# EAGLE schematic BEP33_12panel stencil (EAGLE 7.7.0), part 2 of 4
## Sheet 6 of 14
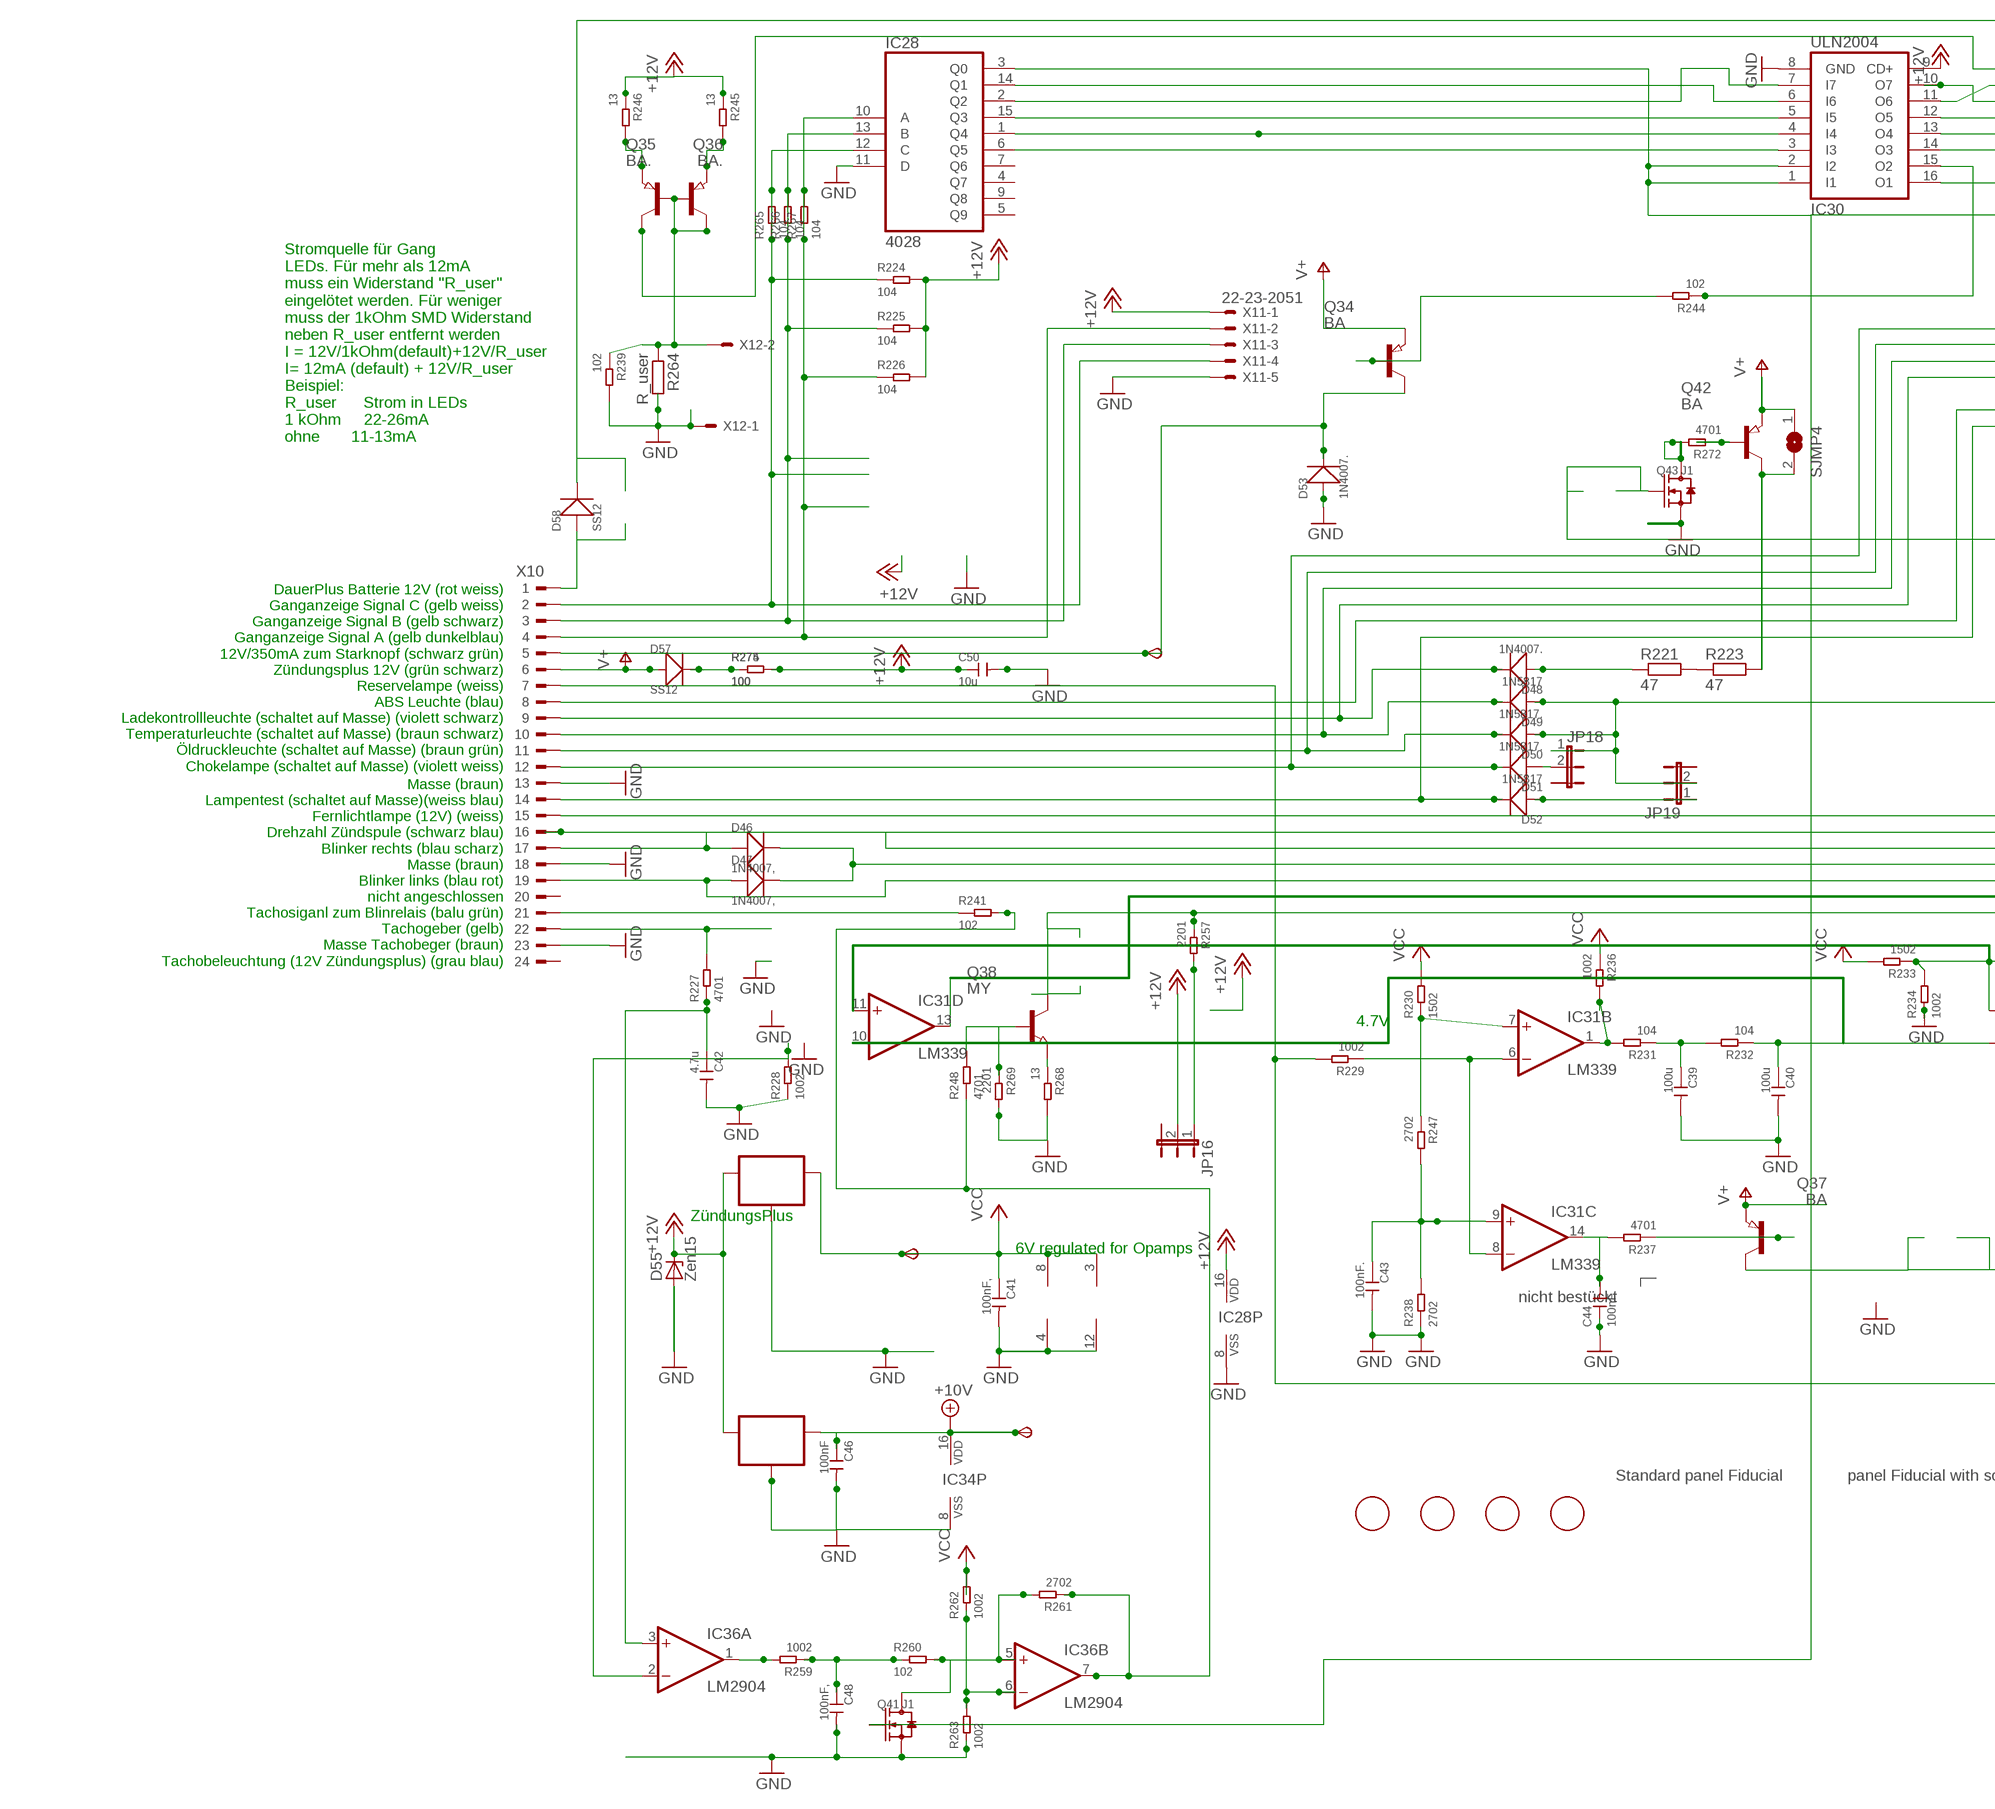
[diagram p9: schematic, sheet 6, part 1 of 2]
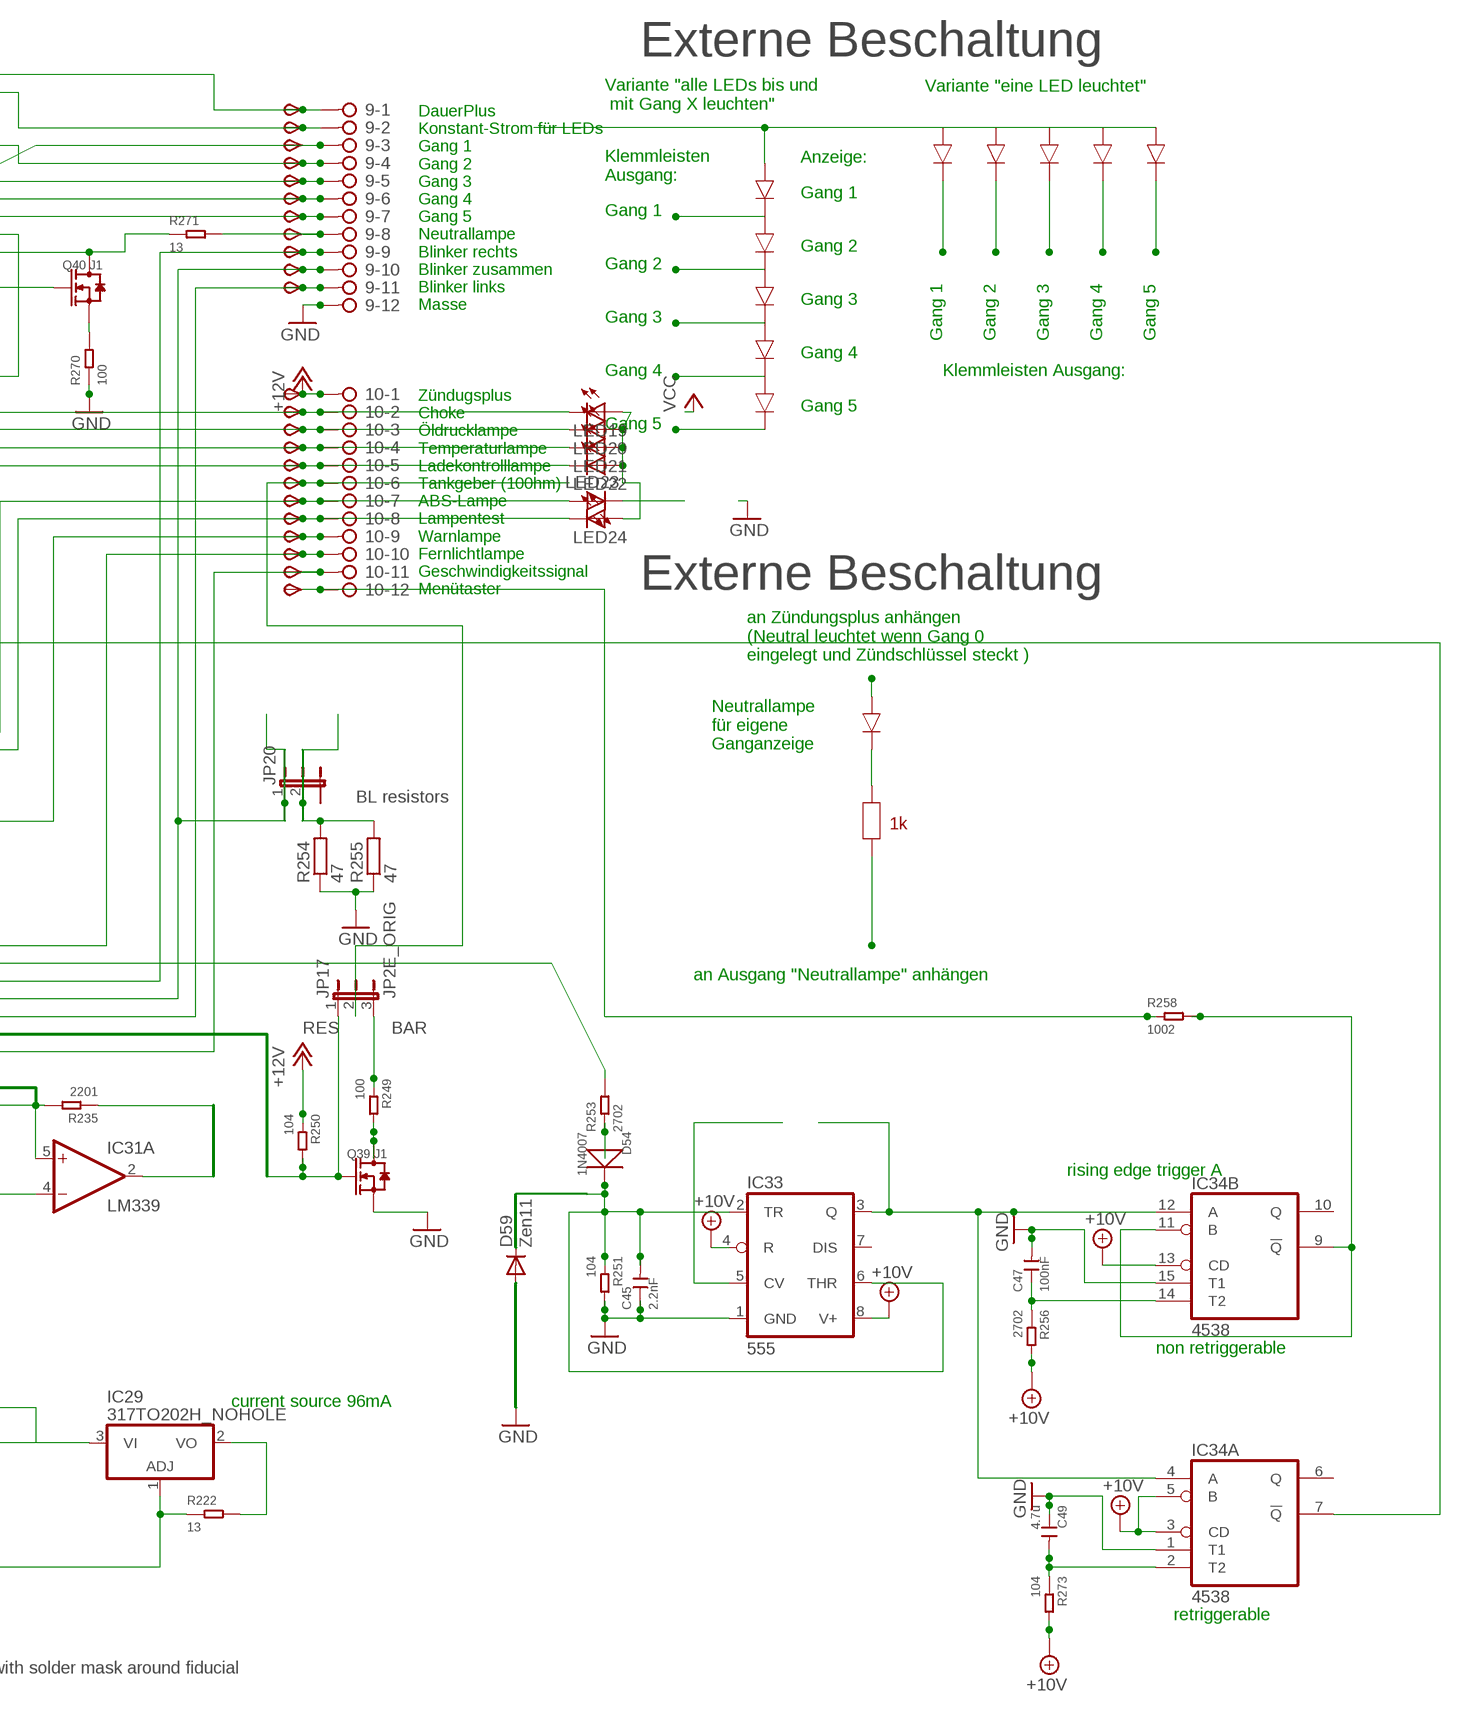
[diagram p10: schematic, sheet 6, part 2 of 2]

### Parts
6V4  TPSB2.0  [B2.0]
9  2081-1132  [12-PIN]
10  2081-1132  [12-PIN]
10V4  TPSB2.0  [B2.0]
C39  100u  CERAMIC-100UF-6.3V-20%-X5R(1206)  [C1206]
C40  100u  CERAMIC-100UF-6.3V-20%-X5R(1206)  [C1206]
C41  100nF,  CERAMIC-100NF-50V-10%-X7R(0805)  [C0805]
C42  4.7u  CERAMIC-4.7UF-25V-10%-X5R(0805)  [C0805]
C43  100nF.  CERAMIC-100NF-50V-10%-X7R(0805)  [C0805]
C44  100nF.  CERAMIC-100NF-50V-10%-X7R(0805)  [C0805]
C45  2.2nF  CERAMIC-100NF-50V-10%-X7R(0805)  [C0805]
C46  100nF  CERAMIC-100NF-50V-10%-X7R(0805)  [C0805]
C47  100nF  CERAMIC-100NF-50V-10%-X7R(0805)  [C0805]
C48  100nF,  CERAMIC-100NF-50V-10%-X7R(0805)  [C0805]
C49  4.7u  CERAMIC-4.7UF-25V-10%-X5R(0805)  [C0805]
C50  10u  CERAMIC-100UF-6.3V-20%-X5R(1206)  [C1206]
D46  1N4007,  DIODE-GEN-PURPOSE-1KV-1A(DO-214AC)  [DO-214AC]
D47  1N4007,  DIODE-GEN-PURPOSE-1KV-1A(DO-214AC)  [DO-214AC]
D48  1N4007.  DIODE-GEN-PURPOSE-1KV-1A(DO-214AC)  [DO-214AC]
D49  1N5817  DIODE-GEN-PURPOSE-1KV-1A(DO-214AC)DO-214AC/1206  [DO-214AC_SLIM]
D50  1N5817.  DIODE-GEN-PURPOSE-1KV-1A(DO-214AC)DO-214AC/1206  [DO-214AC_SLIM]
D51  1N5817.  DIODE-GEN-PURPOSE-1KV-1A(DO-214AC)DO-214AC/1206  [DO-214AC_SLIM]
D52  1N5817  DIODE-GEN-PURPOSE-1KV-1A(DO-214AC)DO-214AC/1206  [DO-214AC_SLIM]
D53  1N4007.  DIODE-GEN-PURPOSE-1KV-1A(DO-214AC)  [DO-214AC]
D54  1N4007  DIODE-GEN-PURPOSE-1KV-1A(DO-214AC)  [DO-214AC]
D55  Zen15  SM6T  [DO214AA]
D57  SS12  DIODE-GEN-PURPOSE-1KV-1A(DO-214AC)DO-214AC/1206  [DO-214AC_SLIM]
D58  SS12  DIODE-GEN-PURPOSE-1KV-1A(DO-214AC)DO-214AC/1206  [DO-214AC_SLIM]
D59  Zen11  CGRM4001-G  [SOD-123_MINI-SMA]
FID15  FIDUCIAL  [FIDUCIAL_1MM]
FID16  FIDUCIAL  [FIDUCIAL_1MM]
FID17  FIDUCIAL  [FIDUCIAL_1MM]
FID18  FIDUCIAL  [FIDUCIAL_1MM]
IC28  4028  4028D  [SO16]
IC29  317TO202H_NOHOLE  [TO220H_NOHOLE]
IC30  ULN2004  ULN2004AD  [SO16]
IC31  LM339  LM339D  [SO14]
IC32  78L06  78LXXSOT89_ROUND  [SOT89_ROUND]
IC33  555  NE555D  [SO08]
IC34  4538  4538D  [SO16]
IC35  78L10  78LXXSOT89_ROUND  [SOT89_ROUND]
IC36  LM2904  LM358D  [SO08]
JP16  JP2EJP2_SMALLPADS  [JP2_SMALLPADS]
JP17  JP2E_ORIG  [JP2_ORIG_SMALLPADS]
JP18  JP2EJP2_SMALLPADS  [JP2_SMALLPADS]
JP19  JP2EJP2_SMALLPADS  [JP2_SMALLPADS]
JP20  JP2EJP2_SMALLPADS  [JP2_SMALLPADS]
LED19  LEDLD260  [LD260]
LED20  LEDLD260  [LD260]
LED21  LEDLD260  [LD260]
LED22  LEDLD260  [LD260]
LED23  LEDLD260  [LD260]
LED24  LEDLD260  [LD260]
Q34  BA  PNP-TRANSISTOR_SOT89  [SOT89]
Q35  BA.  PNP-TRANSISTOR_SOT89  [SOT89]
Q36  BA.  PNP-TRANSISTOR_SOT89  [SOT89]
Q37  BA  PNP-TRANSISTOR_SOT89  [SOT89]
Q38  MY  NPN-TRANSISTOR_SOT89  [SOT89]
Q39  J1  SMD-MOSFET-N-CH-50V-200MA-BSS138W-7-F(SOT-23)  [SOT-23]
Q40  J1  SMD-MOSFET-N-CH-50V-200MA-BSS138W-7-F(SOT-23)  [SOT-23]
Q41  J1  SMD-MOSFET-N-CH-50V-200MA-BSS138W-7-F(SOT-23)  [SOT-23]
Q42  BA  PNP-TRANSISTOR_SOT89  [SOT89]
Q43  J1  SMD-MOSFET-N-CH-50V-200MA-BSS138W-7-F(SOT-23)  [SOT-23]
R221  47  R-EU_V235/17_1MM  [V235/17_1MM]
R222  13  SMD-RES-13R-5%-1/4W(1206)  [R1206]
R223  47  R-EU_V235/17_1MM  [V235/17_1MM]
R224  104  SMD-RES-10K-1%-1/8W(0805)  [R0805]
R225  104  SMD-RES-10K-1%-1/8W(0805)  [R0805]
R226  104  SMD-RES-10K-1%-1/8W(0805)  [R0805]
R227  4701  SMD-RES-4.7K-5%-1/8W(0805)  [R0805]
R228  1002  SMD-RES-10K-1%-1/8W(0805)  [R0805]
R229  1002  SMD-RES-10K-1%-1/8W(0805)  [R0805]
R230  1502  SMD-RES-10K-1%-1/8W(0805)  [R0805]
R231  104  SMD-RES-10K-1%-1/8W(0805)  [R0805]
R232  104  SMD-RES-10K-1%-1/8W(0805)  [R0805]
R233  1502  SMD-RES-10K-1%-1/8W(0805)  [R0805]
R234  1002  SMD-RES-10K-1%-1/8W(0805)  [R0805]
R235  2201  SMD-RES-2.2K-5%-1/8W(0805)  [R0805]
R236  1002  SMD-RES-10K-1%-1/8W(0805)  [R0805]
R237  4701  SMD-RES-4.7K-5%-1/8W(0805)  [R0805]
R238  2702  SMD-RES-4.7K-5%-1/8W(0805)  [R0805]
R239  102  SMD-RES-1K-5%-1/8W(0805)  [R0805]
R241  102  SMD-RES-220R-5%-1/8W(0805)  [R0805]
R244  102  SMD-RES-1K-5%-1/8W(0805)  [R0805]
R245  13  SMD-RES-13R-5%-1/4W(1206)  [R1206]
R246  13  SMD-RES-13R-5%-1/4W(1206)  [R1206]
R247  2702  SMD-RES-4.7K-5%-1/8W(0805)  [R0805]
R248  4701  SMD-RES-4.7K-5%-1/8W(0805)  [R0805]
R249  100  SMD-RES-2.2K-5%-1/8W(0805)  [R0805]
R250  104  SMD-RES-10K-1%-1/8W(0805)  [R0805]
R251  104  SMD-RES-10K-1%-1/8W(0805)  [R0805]
R253  2702  SMD-RES-10K-1%-1/8W(0805)  [R0805]
R254  47  R-EU_V235/17_1MM  [V235/17_1MM]
R255  47  R-EU_V235/17_1MM  [V235/17_1MM]
R256  2702  SMD-RES-4.7K-5%-1/8W(0805)  [R0805]
R257  2201  SMD-RES-2.2K-5%-1/8W(0805)  [R0805]
R258  1002  SMD-RES-4.7K-5%-1/8W(0805)  [R0805]
R259  1002  SMD-RES-10K-1%-1/8W(0805)  [R0805]
R260  102  SMD-RES-1K-5%-1/8W(0805)  [R0805]
R261  2702  SMD-RES-4.7K-5%-1/8W(0805)  [R0805]
R262  1002  SMD-RES-1K-5%-1/8W(0805)  [R0805]
R263  1002  SMD-RES-1K-5%-1/8W(0805)  [R0805]
R264  R_user  R-EU_R0805  [R0805]
R265  104  SMD-RES-10K-1%-1/8W(0805)  [R0805]
R266  104  SMD-RES-10K-1%-1/8W(0805)  [R0805]
R267  104  SMD-RES-10K-1%-1/8W(0805)  [R0805]
R268  13  SMD-RES-13R-5%-1/4W(1206)  [R1206]
R269  2201  SMD-RES-1K-5%-1/8W(0805)  [R0805]
R270  100  SMD-RES-220R-5%-1/8W(0805)  [R0805]
R271  13  SMD-RES-13R-5%-1/4W(1206)  [R1206]
R272  4701  SMD-RES-4.7K-5%-1/8W(0805)  [R0805]
R273  104  SMD-RES-4.7K-5%-1/8W(0805)  [R0805]
R274  100  SMD-RES-2.2K-5%-1/8W(0805)  [R0805]
R275  100  SMD-RES-2.2K-5%-1/8W(0805)  [R0805]
SJMP4  SJ  [SJ]
START4  TPSB2.0  [B2.0]
TP93  TPSB2.0  [B2.0]
TP94  TPSB2.0  [B2.0]
TP95  TPSB2.0  [B2.0]
TP96  TPSB2.0  [B2.0]
TP97  TPSB2.0  [B2.0]
TP98  TPSB2.0  [B2.0]
TP99  TPSB2.0  [B2.0]
TP100  TPSB2.0  [B2.0]
TP101  TPSB2.0  [B2.0]
TP102  TPSB2.0  [B2.0]
TP103  TPSB2.0  [B2.0]
TP104  TPSB2.0  [B2.0]
TP105  TPSB2.0  [B2.0]
TP106  TPSB2.0  [B2.0]
TP107  TPSB2.0  [B2.0]
TP108  TPSB2.0  [B2.0]
TP109  TPSB2.0  [B2.0]
TP110  TPSB2.0  [B2.0]
TP111  TPSB1,27  [B1,27]
TP112  TPSB2.0  [B2.0]
TP113  TPSB2.0  [B2.0]
TP114  TPSB2.0  [B2.0]
TP115  TPSB2.0  [B2.0]
X10  CON_BMWV2  [24-PIN_V2]
X11  22-23-2051  [22-23-2051]
X12  22-23-2021  [22-23-2021]

### Nets
+10V: 10V4.TP(PP) C46.1 IC33.4(R) IC33.8(V+) IC34.3(A:CD) IC34.5(A:B) IC34.13(B:CD) IC34.16(P:VDD) IC35.1(OUT) R256.2 R273.2 ; also sheet 2,3,4,5,7,9,10,11,12,13,14
+12V: 10.1 C50.1 D55.C IC28.16(VDD) IC30.9(CD+) IC32.3(IN) IC35.3(IN) JP16.2 R224.2 R225.2 R226.2 R245.1 R246.1 R250.1 R274.2 R275.2 TP114.TP(PP) X11.1 ; also sheet 2,3,4,5,7,9,10,11,12,13,14
+12V5: 10.11 Q38.2(C) R257.1 TP113.TP(PP)
GND: 9.12 C39.2 C40.2 C41.2 C42.2 C43.2 C44.1 C45.1 C46.2 C47.2 C48.2 C49.1 C50.2 D53.1(+) D55.A D59.A IC28.8(VSS) IC28.11(D) IC30.8(GND) IC31.12(P:GND) IC32.2(GND) IC32.2@1(GND) IC33.1(GND) IC34.1(A:T1) IC34.8(P:VSS) IC34.15(B:T1) IC35.2(GND) IC35.2@1(GND) IC36.4(P:V-) Q39.2(S) Q41.2(S) Q43.2(S) R228.1 R234.1 R238.1 R239.2 R251.2 R254.1 R255.1 R263.1 R264.2 R268.2 R269.2 R270.1 X10.13 X10.18 X10.23 X11.5 X12.1 ; also sheet 2,3,4,5,7,9,10,11,12,13,14
N$939: R221.2 R223.1
N$940: 10.9 D49.1(+) D50.1(+) JP18.1 JP19.2 TP111.TP(PP)
N$941: IC28.10(A) R226.1 R267.1 R267.2 X10.4 X11.2
N$942: IC28.13(B) R225.1 R266.1 R266.2 X10.3 X11.3
N$943: D53.2(-) Q34.2(C) START4.TP(PP) X10.5
N$944: IC28.12(C) R224.1 R265.1 R265.2 X10.2 X11.4
N$945: 10.7 LED23.A TP109.TP(PP) X10.8
N$946: 10.2 D51.2(-) LED19.K(C) TP104.TP(PP) X10.12
N$947: 10.3 D50.2(-) LED20.K(C) TP105.TP(PP) X10.11
N$948: 10.4 D49.2(-) LED21.K(C) TP106.TP(PP) X10.10
N$949: 10.8 D52.2(-) LED24.K(C) TP110.TP(PP) X10.14
N$950: 9.9 D46.1(+) TP101.TP(PP) X10.17
N$951: 9.11 D47.1(+) TP103.TP(PP) X10.19
N$952: R227.2 X10.22
N$953: C42.1 IC36.3(A:+IN) R227.1
N$954: IC31.1(B:OUT) R231.2 R236.2
N$955: C39.1 R231.1 R232.2
N$956: C40.1 IC31.4(A:-IN) IC31.10(D:-IN) R232.1
N$957: IC31.5(A:+IN) IC31.11(D:+IN) R233.1 R234.2 R235.2
N$958: C43.1 IC31.9(C:+IN) R238.2 R247.2
N$959: C44.2 IC31.14(C:OUT) R237.2
N$960: Q37.1(B) R237.1
N$961: IC28.2(Q2) IC30.7(I7)
N$962: 9.5 IC30.12(O5) TP97.TP(PP)
N$963: IC28.1(Q4) IC30.4(I4)
N$964: 10.10 TP112.TP(PP) X10.15
N$965: 10.5 D48.2(-) LED22.K(C) TP107.TP(PP) X10.9
N$966: D48.1(+) R221.1
N$967: IC28.6(Q5) IC30.3(I3)
N$968: 9.4 IC30.10(O7) TP96.TP(PP)
N$969: IC29.1(ADJ) R222.1 R229.2 X10.7
N$970: IC31.6(B:-IN) IC31.8(C:-IN) R229.1
N$971: 9.2 Q36.2(C) TP94.TP(PP)
N$972: 9.1 D58.2(-) TP93.TP(PP)
N$986: R253.2 X10.16
N$987: IC28.15(Q3) IC30.5(I5)
N$988: 9.6 IC30.13(O4) TP98.TP(PP)
N$989: 9.7 IC30.14(O3) TP99.TP(PP)
N$990: 10.6 JP17.2 TP108.TP(PP)
N$991: LED23.K(C)
N$992: LED19.A LED20.A LED21.A LED22.A LED24.A
N$993: Q34.1(B) R244.2
N$994: IC28.3(Q0) IC30.1(I1) IC30.2(I2) Q40.1(G) Q41.1(G)
N$995: IC28.14(Q1) IC30.6(I6)
N$996: 9.3 IC30.11(O6) TP95.TP(PP)
N$997: Q35.1(B) Q35.2(C) Q36.1(B) R239.1 R264.1 X12.2
N$998: Q36.3(E) R246.2
N$999: Q35.3(E) R245.2
N$1000: IC31.7(B:+IN) R230.1 R247.1
N$1001: IC36.2(A:-IN) R228.2
N$1002: Q38.1(B) R248.2 R269.1
N$1003: Q39.3(D) R249.2
N$1004: IC29.2(VO) R222.2
N$1005: IC29.3(VI) Q37.2(C)
N$1006: IC33.5(CV)
N$1007: IC33.3(Q) IC34.4(A:A) IC34.12(B:A)
N$1008: D54.1(+) R253.1
N$1009: 9.10 D46.2(-) D47.2(-) JP20.1 TP102.TP(PP)
N$1010: JP20.2 R254.2 R255.2
N$1011: IC34.9(B:!Q) IC34.11(B:B) R258.2
N$1012: C47.1 IC34.14(B:T2) R256.1
N$1013: JP16.1 R257.2
N$1014: IC30.15(O2) R244.1
N$1015: 10.12 R258.1 TP115.TP(PP)
N$1016: D51.1(+) JP18.2
N$1017: IC36.1(A:OUT) R259.2
N$1018: C48.1 R259.1 R260.1
N$1019: IC36.5(B:+IN) Q41.3(D) R260.2 R261.2
N$1020: IC36.6(B:-IN) R262.1 R263.2
N$1021: D52.1(+) JP19.1
N$1022: JP17.3 R249.1
N$1023: IC31.13(D:OUT) JP17.1 Q39.1(G) R250.2
N$1024: R241.1 X10.21
N$1025: IC30.16(O1) Q40.3(D) R271.1
N$1026: D57.2(-) R274.1 R275.1
N$1027: 9.8 R271.2 TP100.TP(PP)
N$1028: Q40.2(S) R270.2
N$1029: D58.1(+) X10.1
N$1030: Q38.3(E) R268.1
N$1031: C45.2 D54.2(-) D59.C IC33.2(TR) IC33.6(THR) R251.1
N$1032: Q42.1(B) R272.1
N$1033: Q43.3(D) R272.2
N$1034: Q42.2(C) R223.2 SJMP4.2
N$1035: IC36.7(B:OUT) R241.2 R248.1 R261.1
N$1036: IC31.2(A:OUT) R235.1
N$1037: IC34.7(A:!Q) Q43.1(G)
N$1038: C49.2 IC34.2(A:T2) R273.1
V+: D57.1(+) Q34.3(E) Q37.3(E) Q42.3(E) SJMP4.1 X10.6 ; also sheet 2,3,4,5,7,9,10,11,12,13,14
VCC: 6V4.TP(PP) C41.1 IC31.3(P:V+) IC32.1(OUT) IC36.8(P:V+) R230.2 R233.2 R236.1 R262.2 ; also sheet 2,3,4,5,7,9,10,11,12,13,14
Unconnected: IC28.4(Q7) IC28.5(Q9) IC28.7(Q6) IC28.9(Q8) IC33.7(DIS) IC34.6(A:Q) IC34.10(B:Q) X10.20 X10.24

### Notes on the sheet
- Externe Beschaltung
- Variante "eine LED leuchtet"
- Variante "alle LEDs bis und
   mit Gang X leuchten"
- Anzeige:
- Klemmleisten
  Ausgang:
- Gang 1
- DauerPlus
  Konstant-Strom für LEDs
  Gang 1
  Gang 2
  Gang 3
  Gang 4
  Gang 5
  Neutrallampe
  Blinker rechts
  Blinker zusammen
  Blinker links
  Masse
- Gang 1
- Gang 2
- Gang 2
- Gang 3
- Gang 3
- Gang 1 | Gang 2 | Gang 3 | Gang 4 | Gang 5
- Gang 4
- Gang 4 | Klemmleisten Ausgang:
- Gang 5
- Gang 5
- Zündugsplus
  Choke
  Öldrucklampe
  Temperaturlampe
  Ladekontrolllampe
  Tankgeber (100hm)
  ABS-Lampe
  Lampentest
  Warnlampe
  Fernlichtlampe
  Geschwindigkeitssignal
  Menütaster
- Stromquelle für Gang
  LEDs. Für mehr als 12mA
  muss ein Widerstand "R_user"
  eingelötet werden. Für weniger
  muss der 1kOhm SMD Widerstand
  neben R_user entfernt werden
  I = 12V/1kOhm(default)+12V/R_user
  I= 12mA (default) + 12V/R_user
  Beispiel:
  R_user      Strom in LEDs
  1 kOhm     22-26mA
  ohne       11-13mA
- Externe Beschaltung
- an Zündungsplus anhängen
  (Neutral leuchtet wenn Gang 0
  eingelegt und Zündschlüssel steckt )
- Neutrallampe
  für eigene
  Ganganzeige
- DauerPlus Batterie 12V (rot weiss)
  Ganganzeige Signal C (gelb weiss)
  Ganganzeige Signal B (gelb schwarz)
  Ganganzeige Signal A (gelb dunkelblau)
  12V/350mA zum Starknopf (schwarz grün)
  Zündungsplus 12V (grün schwarz)
  Reservelampe (weiss)
  ABS Leuchte (blau)
  Ladekontrollleuchte (schaltet auf Masse) (violett schwarz)
  Temperaturleuchte (schaltet auf Masse) (braun schwarz)
  Öldruckleuchte (schaltet auf Masse) (braun grün)
  Chokelampe (schaltet auf Masse) (violett weiss)
- BL resistors
- 1k
- an Ausgang "Neutrallampe" anhängen
- Masse (braun)
  Lampentest (schaltet auf Masse)(weiss blau)
  Fernlichtlampe (12V) (weiss)
  Drehzahl Zündspule (schwarz blau)
  Blinker rechts (blau scharz)
  Masse (braun)
  Blinker links (blau rot)
  nicht angeschlossen
  Tachosiganl zum Blinrelais (balu grün)
  Tachogeber (gelb)
  Masse Tachobeger (braun)
  Tachobeleuchtung (12V Zündungsplus) (grau blau)
- RES | BAR
- 4.7V | rising edge trigger A
- non retriggerable
- ZündungsPlus
- current source 96mA
- 6V regulated for Opamps
- nicht bestückt
- retriggerable
- Standard panel Fiducial | panel Fiducial with solder mask around fiducial

## Sheet 7 of 14
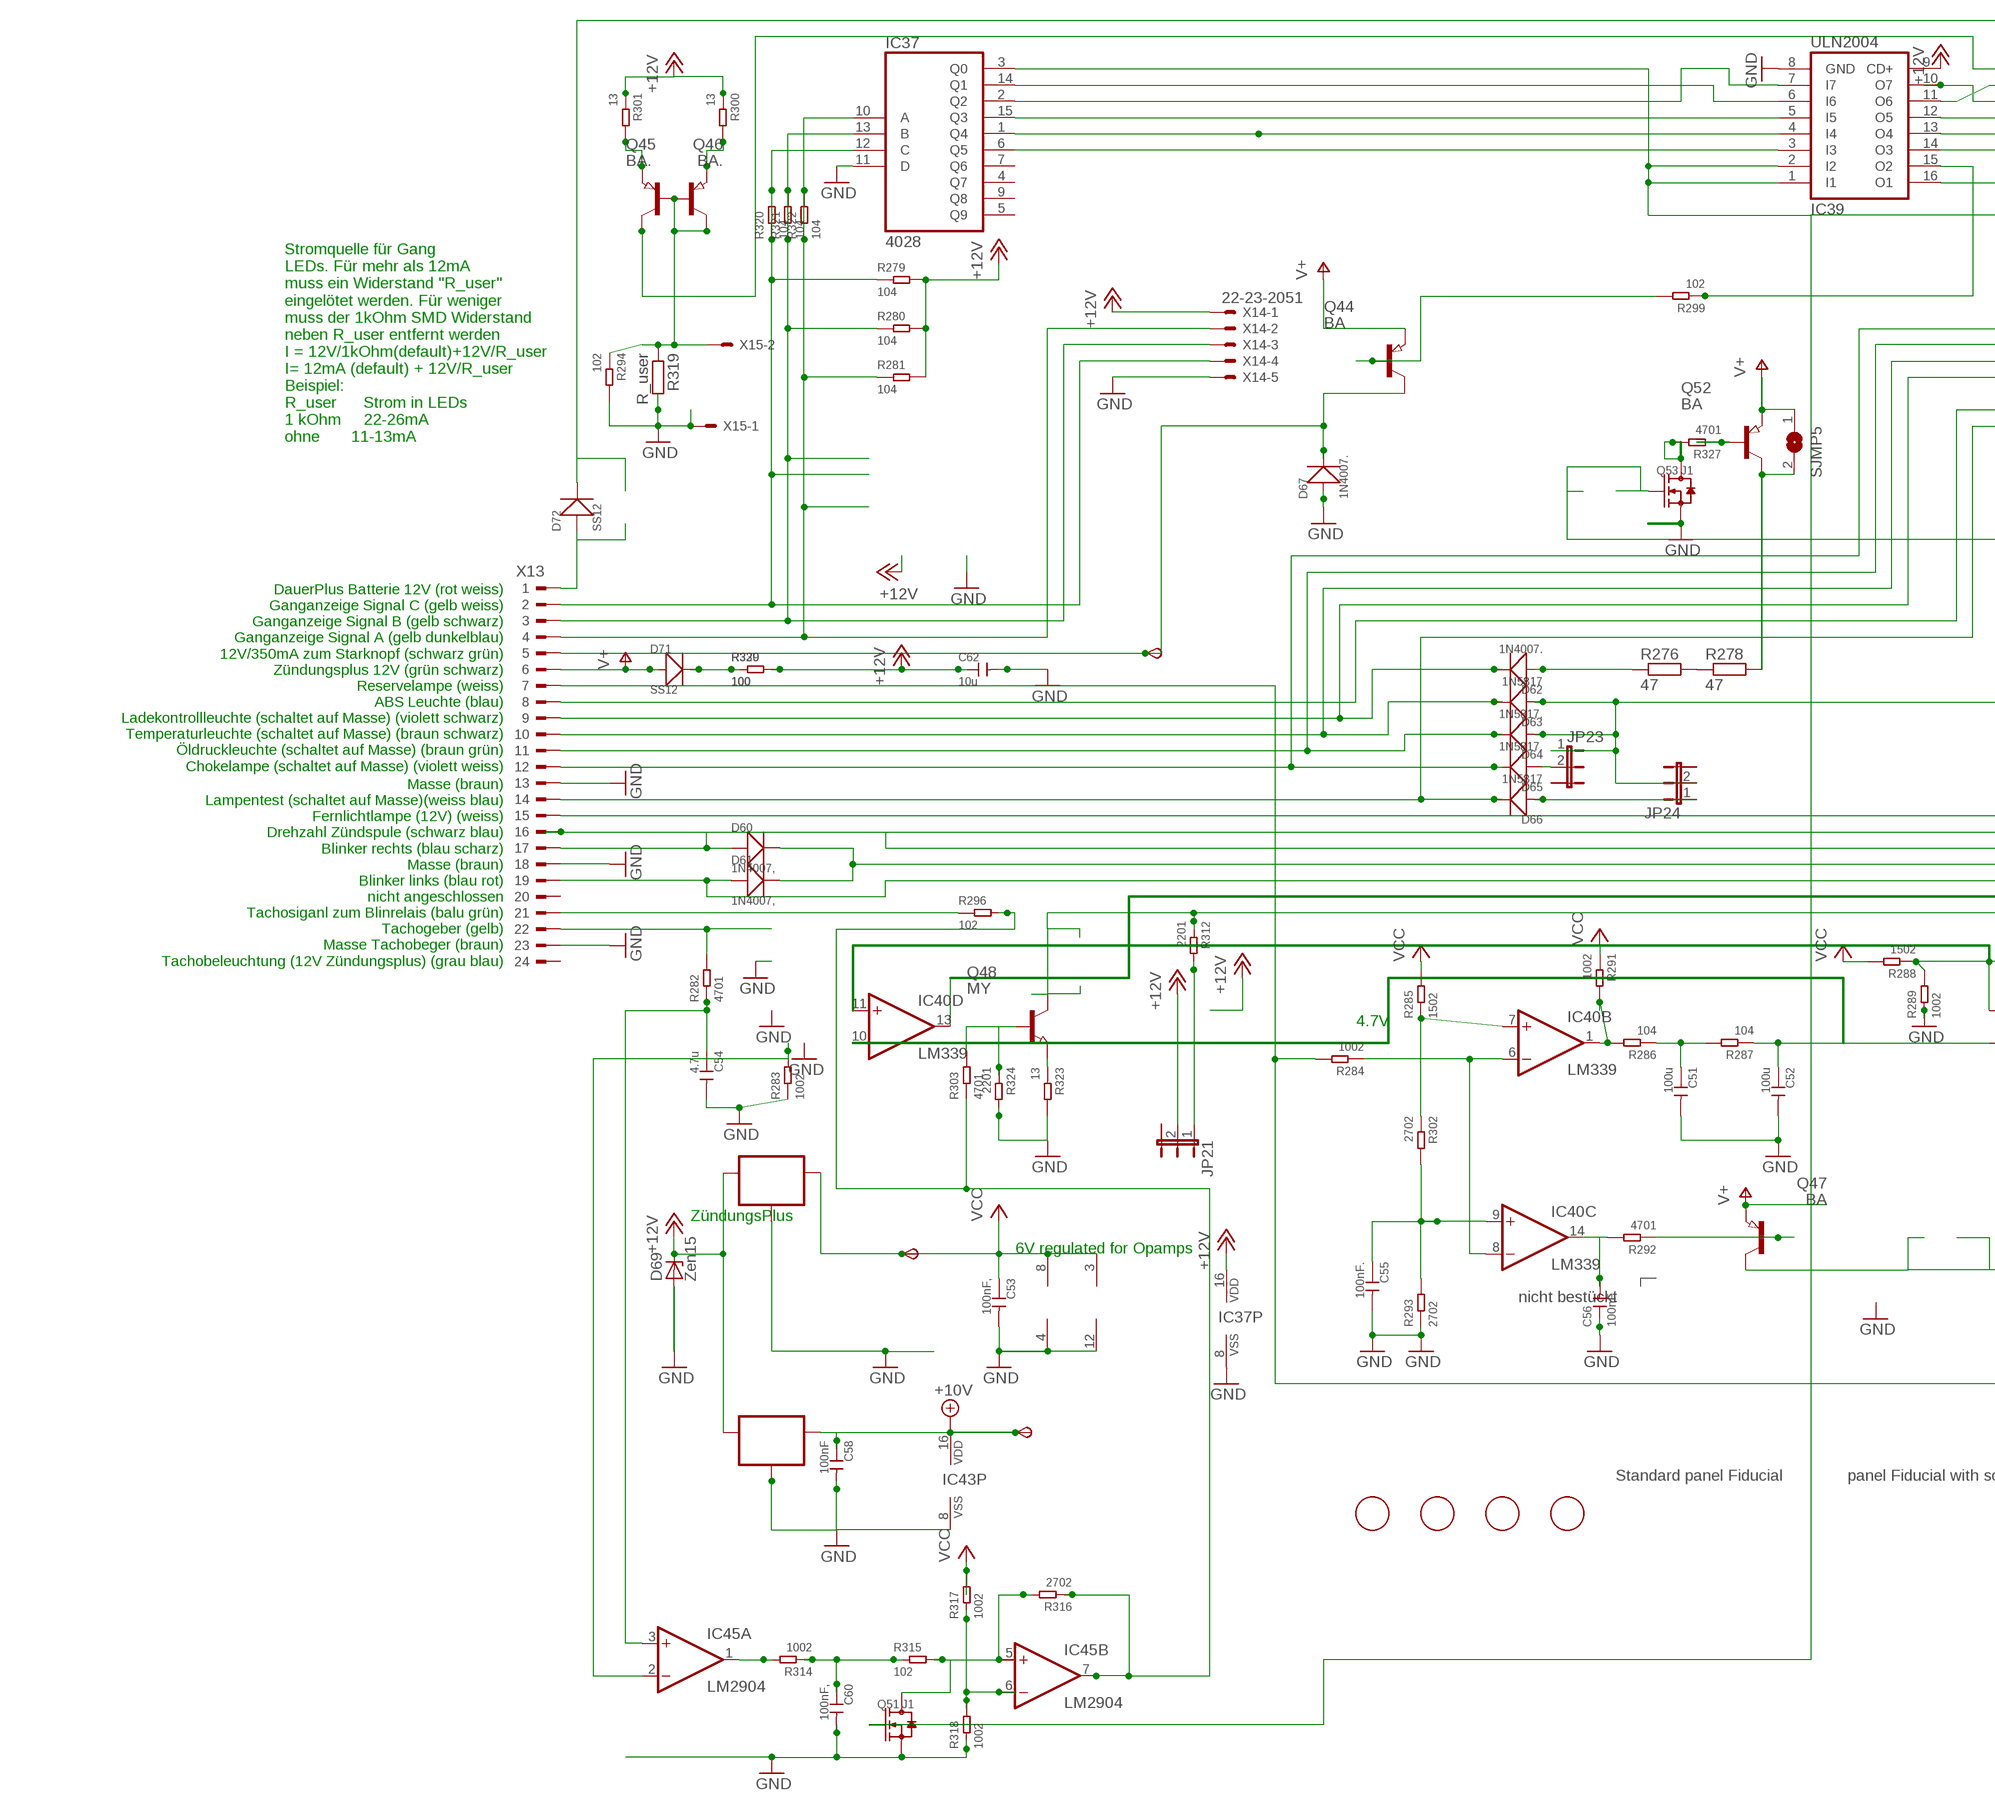
[diagram p11: schematic, sheet 7, part 1 of 2]
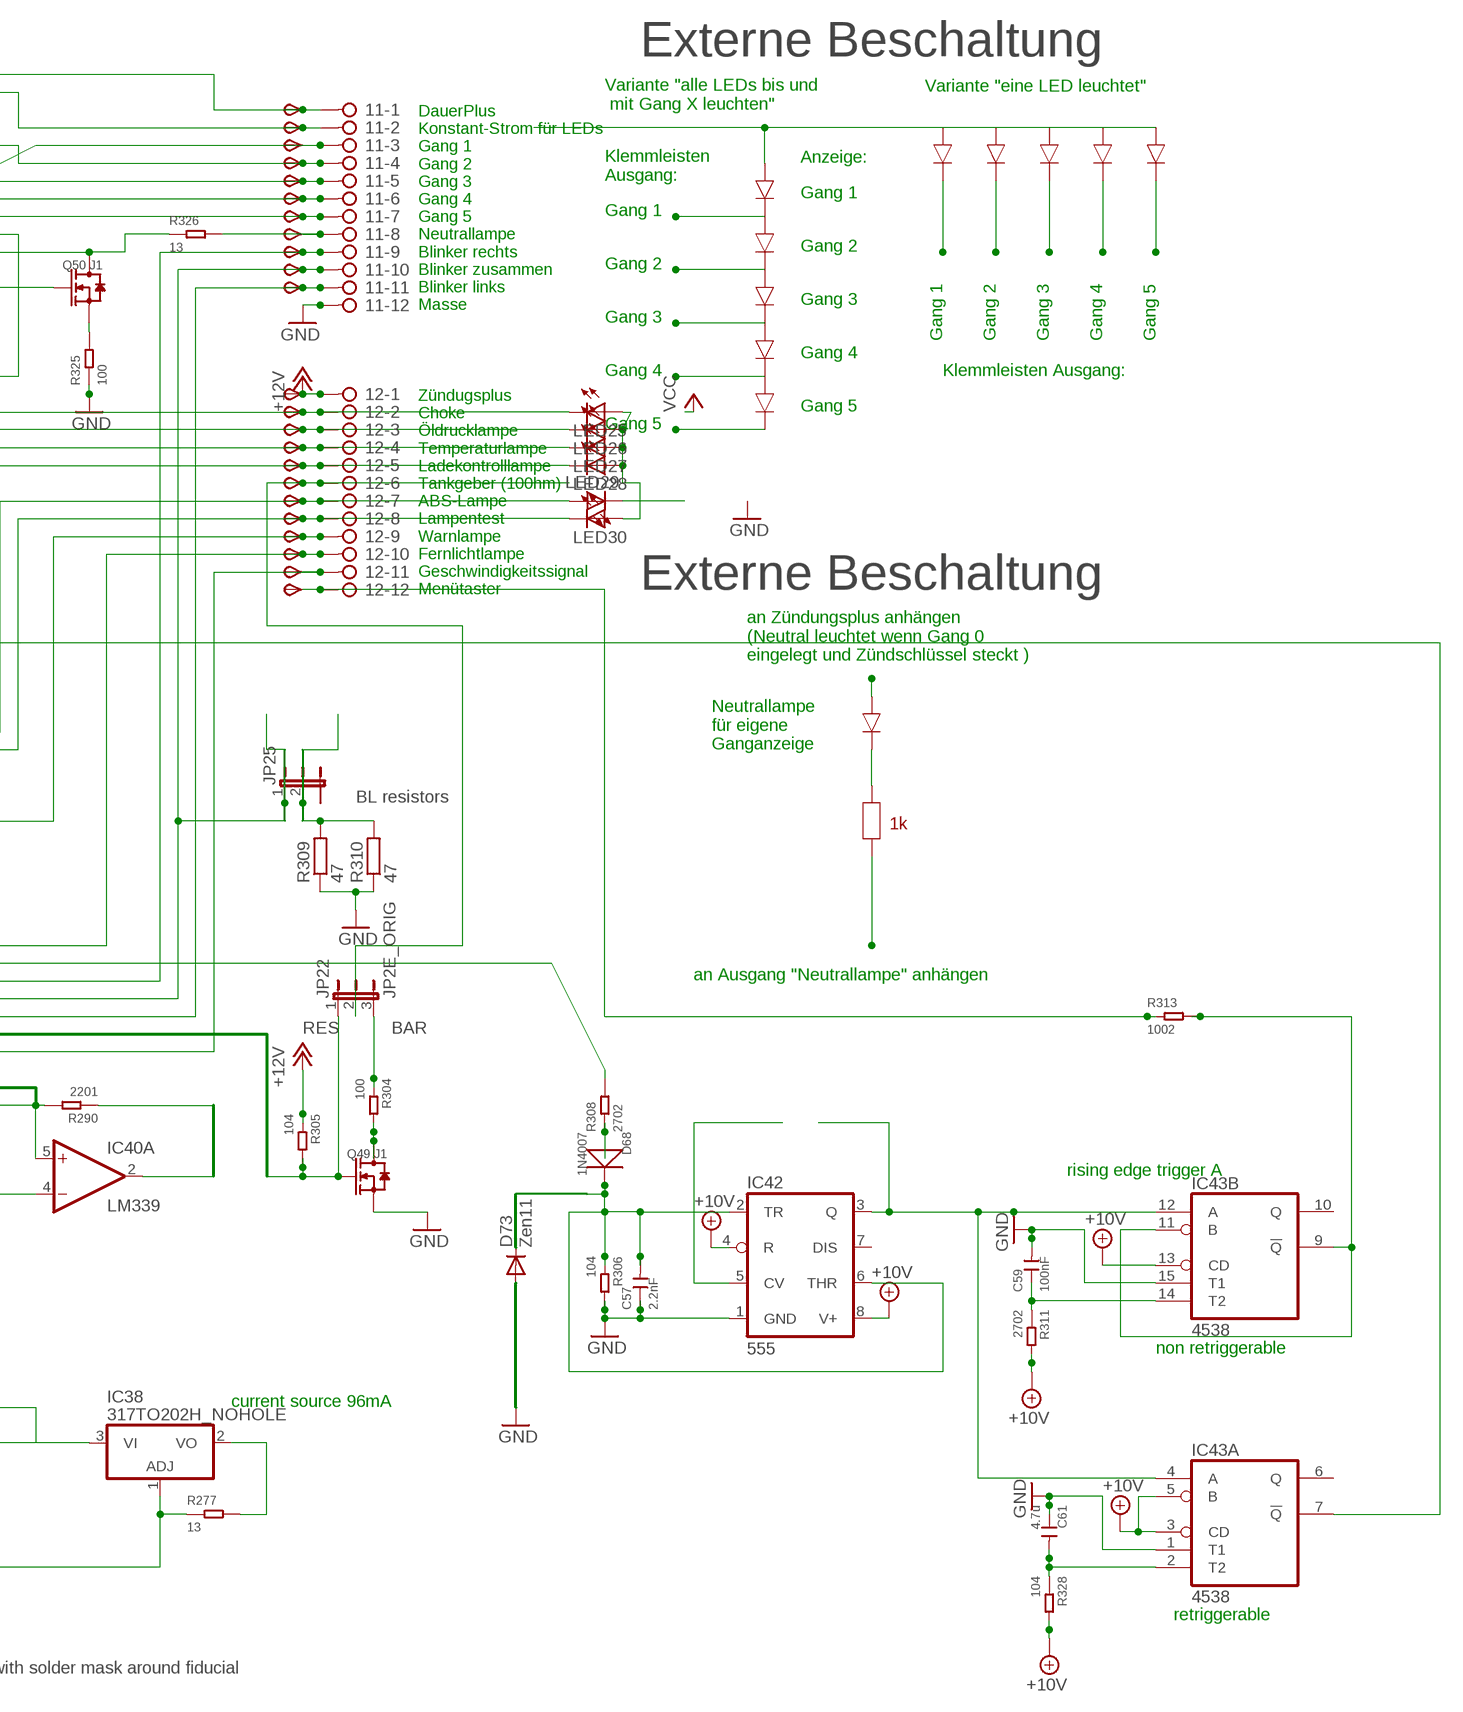
[diagram p12: schematic, sheet 7, part 2 of 2]

### Parts
6V5  TPSB2.0  [B2.0]
10V5  TPSB2.0  [B2.0]
11  2081-1132  [12-PIN]
12  2081-1132  [12-PIN]
C51  100u  CERAMIC-100UF-6.3V-20%-X5R(1206)  [C1206]
C52  100u  CERAMIC-100UF-6.3V-20%-X5R(1206)  [C1206]
C53  100nF,  CERAMIC-100NF-50V-10%-X7R(0805)  [C0805]
C54  4.7u  CERAMIC-4.7UF-25V-10%-X5R(0805)  [C0805]
C55  100nF.  CERAMIC-100NF-50V-10%-X7R(0805)  [C0805]
C56  100nF.  CERAMIC-100NF-50V-10%-X7R(0805)  [C0805]
C57  2.2nF  CERAMIC-100NF-50V-10%-X7R(0805)  [C0805]
C58  100nF  CERAMIC-100NF-50V-10%-X7R(0805)  [C0805]
C59  100nF  CERAMIC-100NF-50V-10%-X7R(0805)  [C0805]
C60  100nF,  CERAMIC-100NF-50V-10%-X7R(0805)  [C0805]
C61  4.7u  CERAMIC-4.7UF-25V-10%-X5R(0805)  [C0805]
C62  10u  CERAMIC-100UF-6.3V-20%-X5R(1206)  [C1206]
D60  1N4007,  DIODE-GEN-PURPOSE-1KV-1A(DO-214AC)  [DO-214AC]
D61  1N4007,  DIODE-GEN-PURPOSE-1KV-1A(DO-214AC)  [DO-214AC]
D62  1N4007.  DIODE-GEN-PURPOSE-1KV-1A(DO-214AC)  [DO-214AC]
D63  1N5817  DIODE-GEN-PURPOSE-1KV-1A(DO-214AC)DO-214AC/1206  [DO-214AC_SLIM]
D64  1N5817.  DIODE-GEN-PURPOSE-1KV-1A(DO-214AC)DO-214AC/1206  [DO-214AC_SLIM]
D65  1N5817.  DIODE-GEN-PURPOSE-1KV-1A(DO-214AC)DO-214AC/1206  [DO-214AC_SLIM]
D66  1N5817  DIODE-GEN-PURPOSE-1KV-1A(DO-214AC)DO-214AC/1206  [DO-214AC_SLIM]
D67  1N4007.  DIODE-GEN-PURPOSE-1KV-1A(DO-214AC)  [DO-214AC]
D68  1N4007  DIODE-GEN-PURPOSE-1KV-1A(DO-214AC)  [DO-214AC]
D69  Zen15  SM6T  [DO214AA]
D71  SS12  DIODE-GEN-PURPOSE-1KV-1A(DO-214AC)DO-214AC/1206  [DO-214AC_SLIM]
D72  SS12  DIODE-GEN-PURPOSE-1KV-1A(DO-214AC)DO-214AC/1206  [DO-214AC_SLIM]
D73  Zen11  CGRM4001-G  [SOD-123_MINI-SMA]
FID19  FIDUCIAL  [FIDUCIAL_1MM]
FID20  FIDUCIAL  [FIDUCIAL_1MM]
FID21  FIDUCIAL  [FIDUCIAL_1MM]
FID22  FIDUCIAL  [FIDUCIAL_1MM]
IC37  4028  4028D  [SO16]
IC38  317TO202H_NOHOLE  [TO220H_NOHOLE]
IC39  ULN2004  ULN2004AD  [SO16]
IC40  LM339  LM339D  [SO14]
IC41  78L06  78LXXSOT89_ROUND  [SOT89_ROUND]
IC42  555  NE555D  [SO08]
IC43  4538  4538D  [SO16]
IC44  78L10  78LXXSOT89_ROUND  [SOT89_ROUND]
IC45  LM2904  LM358D  [SO08]
JP21  JP2EJP2_SMALLPADS  [JP2_SMALLPADS]
JP22  JP2E_ORIG  [JP2_ORIG_SMALLPADS]
JP23  JP2EJP2_SMALLPADS  [JP2_SMALLPADS]
JP24  JP2EJP2_SMALLPADS  [JP2_SMALLPADS]
JP25  JP2EJP2_SMALLPADS  [JP2_SMALLPADS]
LED25  LEDLD260  [LD260]
LED26  LEDLD260  [LD260]
LED27  LEDLD260  [LD260]
LED28  LEDLD260  [LD260]
LED29  LEDLD260  [LD260]
LED30  LEDLD260  [LD260]
Q44  BA  PNP-TRANSISTOR_SOT89  [SOT89]
Q45  BA.  PNP-TRANSISTOR_SOT89  [SOT89]
Q46  BA.  PNP-TRANSISTOR_SOT89  [SOT89]
Q47  BA  PNP-TRANSISTOR_SOT89  [SOT89]
Q48  MY  NPN-TRANSISTOR_SOT89  [SOT89]
Q49  J1  SMD-MOSFET-N-CH-50V-200MA-BSS138W-7-F(SOT-23)  [SOT-23]
Q50  J1  SMD-MOSFET-N-CH-50V-200MA-BSS138W-7-F(SOT-23)  [SOT-23]
Q51  J1  SMD-MOSFET-N-CH-50V-200MA-BSS138W-7-F(SOT-23)  [SOT-23]
Q52  BA  PNP-TRANSISTOR_SOT89  [SOT89]
Q53  J1  SMD-MOSFET-N-CH-50V-200MA-BSS138W-7-F(SOT-23)  [SOT-23]
R276  47  R-EU_V235/17_1MM  [V235/17_1MM]
R277  13  SMD-RES-13R-5%-1/4W(1206)  [R1206]
R278  47  R-EU_V235/17_1MM  [V235/17_1MM]
R279  104  SMD-RES-10K-1%-1/8W(0805)  [R0805]
R280  104  SMD-RES-10K-1%-1/8W(0805)  [R0805]
R281  104  SMD-RES-10K-1%-1/8W(0805)  [R0805]
R282  4701  SMD-RES-4.7K-5%-1/8W(0805)  [R0805]
R283  1002  SMD-RES-10K-1%-1/8W(0805)  [R0805]
R284  1002  SMD-RES-10K-1%-1/8W(0805)  [R0805]
R285  1502  SMD-RES-10K-1%-1/8W(0805)  [R0805]
R286  104  SMD-RES-10K-1%-1/8W(0805)  [R0805]
R287  104  SMD-RES-10K-1%-1/8W(0805)  [R0805]
R288  1502  SMD-RES-10K-1%-1/8W(0805)  [R0805]
R289  1002  SMD-RES-10K-1%-1/8W(0805)  [R0805]
R290  2201  SMD-RES-2.2K-5%-1/8W(0805)  [R0805]
R291  1002  SMD-RES-10K-1%-1/8W(0805)  [R0805]
R292  4701  SMD-RES-4.7K-5%-1/8W(0805)  [R0805]
R293  2702  SMD-RES-4.7K-5%-1/8W(0805)  [R0805]
R294  102  SMD-RES-1K-5%-1/8W(0805)  [R0805]
R296  102  SMD-RES-220R-5%-1/8W(0805)  [R0805]
R299  102  SMD-RES-1K-5%-1/8W(0805)  [R0805]
R300  13  SMD-RES-13R-5%-1/4W(1206)  [R1206]
R301  13  SMD-RES-13R-5%-1/4W(1206)  [R1206]
R302  2702  SMD-RES-4.7K-5%-1/8W(0805)  [R0805]
R303  4701  SMD-RES-4.7K-5%-1/8W(0805)  [R0805]
R304  100  SMD-RES-2.2K-5%-1/8W(0805)  [R0805]
R305  104  SMD-RES-10K-1%-1/8W(0805)  [R0805]
R306  104  SMD-RES-10K-1%-1/8W(0805)  [R0805]
R308  2702  SMD-RES-10K-1%-1/8W(0805)  [R0805]
R309  47  R-EU_V235/17_1MM  [V235/17_1MM]
R310  47  R-EU_V235/17_1MM  [V235/17_1MM]
R311  2702  SMD-RES-4.7K-5%-1/8W(0805)  [R0805]
R312  2201  SMD-RES-2.2K-5%-1/8W(0805)  [R0805]
R313  1002  SMD-RES-4.7K-5%-1/8W(0805)  [R0805]
R314  1002  SMD-RES-10K-1%-1/8W(0805)  [R0805]
R315  102  SMD-RES-1K-5%-1/8W(0805)  [R0805]
R316  2702  SMD-RES-4.7K-5%-1/8W(0805)  [R0805]
R317  1002  SMD-RES-1K-5%-1/8W(0805)  [R0805]
R318  1002  SMD-RES-1K-5%-1/8W(0805)  [R0805]
R319  R_user  R-EU_R0805  [R0805]
R320  104  SMD-RES-10K-1%-1/8W(0805)  [R0805]
R321  104  SMD-RES-10K-1%-1/8W(0805)  [R0805]
R322  104  SMD-RES-10K-1%-1/8W(0805)  [R0805]
R323  13  SMD-RES-13R-5%-1/4W(1206)  [R1206]
R324  2201  SMD-RES-1K-5%-1/8W(0805)  [R0805]
R325  100  SMD-RES-220R-5%-1/8W(0805)  [R0805]
R326  13  SMD-RES-13R-5%-1/4W(1206)  [R1206]
R327  4701  SMD-RES-4.7K-5%-1/8W(0805)  [R0805]
R328  104  SMD-RES-4.7K-5%-1/8W(0805)  [R0805]
R329  100  SMD-RES-2.2K-5%-1/8W(0805)  [R0805]
R330  100  SMD-RES-2.2K-5%-1/8W(0805)  [R0805]
SJMP5  SJ  [SJ]
START5  TPSB2.0  [B2.0]
TP116  TPSB2.0  [B2.0]
TP117  TPSB2.0  [B2.0]
TP118  TPSB2.0  [B2.0]
TP119  TPSB2.0  [B2.0]
TP120  TPSB2.0  [B2.0]
TP121  TPSB2.0  [B2.0]
TP122  TPSB2.0  [B2.0]
TP123  TPSB2.0  [B2.0]
TP124  TPSB2.0  [B2.0]
TP125  TPSB2.0  [B2.0]
TP126  TPSB2.0  [B2.0]
TP127  TPSB2.0  [B2.0]
TP128  TPSB2.0  [B2.0]
TP129  TPSB2.0  [B2.0]
TP130  TPSB2.0  [B2.0]
TP131  TPSB2.0  [B2.0]
TP132  TPSB2.0  [B2.0]
TP133  TPSB2.0  [B2.0]
TP134  TPSB1,27  [B1,27]
TP135  TPSB2.0  [B2.0]
TP136  TPSB2.0  [B2.0]
TP137  TPSB2.0  [B2.0]
TP138  TPSB2.0  [B2.0]
X13  CON_BMWV2  [24-PIN_V2]
X14  22-23-2051  [22-23-2051]
X15  22-23-2021  [22-23-2021]

### Nets
+10V: 10V5.TP(PP) C58.1 IC42.4(R) IC42.8(V+) IC43.3(A:CD) IC43.5(A:B) IC43.13(B:CD) IC43.16(P:VDD) IC44.1(OUT) R311.2 R328.2 ; also sheet 2,3,4,5,6,9,10,11,12,13,14
+12V: 12.1 C62.1 D69.C IC37.16(VDD) IC39.9(CD+) IC41.3(IN) IC44.3(IN) JP21.2 R279.2 R280.2 R281.2 R300.1 R301.1 R305.1 R329.2 R330.2 TP137.TP(PP) X14.1 ; also sheet 2,3,4,5,6,9,10,11,12,13,14
+12V6: 12.11 Q48.2(C) R312.1 TP136.TP(PP)
GND: 11.12 C51.2 C52.2 C53.2 C54.2 C55.2 C56.1 C57.1 C58.2 C59.2 C60.2 C61.1 C62.2 D67.1(+) D69.A D73.A IC37.8(VSS) IC37.11(D) IC39.8(GND) IC40.12(P:GND) IC41.2(GND) IC41.2@1(GND) IC42.1(GND) IC43.1(A:T1) IC43.8(P:VSS) IC43.15(B:T1) IC44.2(GND) IC44.2@1(GND) IC45.4(P:V-) Q49.2(S) Q51.2(S) Q53.2(S) R283.1 R289.1 R293.1 R294.2 R306.2 R309.1 R310.1 R318.1 R319.2 R323.2 R324.2 R325.1 X13.13 X13.18 X13.23 X14.5 X15.1 ; also sheet 2,3,4,5,6,9,10,11,12,13,14
N$1162: R276.2 R278.1
N$1163: 12.9 D63.1(+) D64.1(+) JP23.1 JP24.2 TP134.TP(PP)
N$1164: IC37.10(A) R281.1 R322.1 R322.2 X13.4 X14.2
N$1165: IC37.13(B) R280.1 R321.1 R321.2 X13.3 X14.3
N$1166: D67.2(-) Q44.2(C) START5.TP(PP) X13.5
N$1167: IC37.12(C) R279.1 R320.1 R320.2 X13.2 X14.4
N$1173: 12.7 LED29.A TP132.TP(PP) X13.8
N$1174: 12.2 D65.2(-) LED25.K(C) TP127.TP(PP) X13.12
N$1180: 12.3 D64.2(-) LED26.K(C) TP128.TP(PP) X13.11
N$1181: 12.4 D63.2(-) LED27.K(C) TP129.TP(PP) X13.10
N$1187: 12.8 D66.2(-) LED30.K(C) TP133.TP(PP) X13.14
N$1188: 11.9 D60.1(+) TP124.TP(PP) X13.17
N$1189: 11.11 D61.1(+) TP126.TP(PP) X13.19
N$1190: R282.2 X13.22
N$1191: C54.1 IC45.3(A:+IN) R282.1
N$1192: IC40.1(B:OUT) R286.2 R291.2
N$1193: C51.1 R286.1 R287.2
N$1194: C52.1 IC40.4(A:-IN) IC40.10(D:-IN) R287.1
N$1195: IC40.5(A:+IN) IC40.11(D:+IN) R288.1 R289.2 R290.2
N$1196: C55.1 IC40.9(C:+IN) R293.2 R302.2
N$1197: C56.2 IC40.14(C:OUT) R292.2
N$1198: Q47.1(B) R292.1
N$1199: IC37.2(Q2) IC39.7(I7)
N$1200: 11.5 IC39.12(O5) TP120.TP(PP)
N$1201: IC37.1(Q4) IC39.4(I4)
N$1202: 12.10 TP135.TP(PP) X13.15
N$1203: 12.5 D62.2(-) LED28.K(C) TP130.TP(PP) X13.9
N$1204: D62.1(+) R276.1
N$1205: IC37.6(Q5) IC39.3(I3)
N$1206: 11.4 IC39.10(O7) TP119.TP(PP)
N$1207: IC38.1(ADJ) R277.1 R284.2 X13.7
N$1208: IC40.6(B:-IN) IC40.8(C:-IN) R284.1
N$1209: 11.2 Q46.2(C) TP117.TP(PP)
N$1210: 11.1 D72.2(-) TP116.TP(PP)
N$1224: R308.2 X13.16
N$1225: IC37.15(Q3) IC39.5(I5)
N$1226: 11.6 IC39.13(O4) TP121.TP(PP)
N$1227: 11.7 IC39.14(O3) TP122.TP(PP)
N$1228: 12.6 JP22.2 TP131.TP(PP)
N$1229: LED29.K(C)
N$1230: LED25.A LED26.A LED27.A LED28.A LED30.A
N$1231: Q44.1(B) R299.2
N$1232: IC37.3(Q0) IC39.1(I1) IC39.2(I2) Q50.1(G) Q51.1(G)
N$1233: IC37.14(Q1) IC39.6(I6)
N$1234: 11.3 IC39.11(O6) TP118.TP(PP)
N$1235: Q45.1(B) Q45.2(C) Q46.1(B) R294.1 R319.1 X15.2
N$1236: Q46.3(E) R301.2
N$1237: Q45.3(E) R300.2
N$1238: IC40.7(B:+IN) R285.1 R302.1
N$1239: IC45.2(A:-IN) R283.2
N$1240: Q48.1(B) R303.2 R324.1
N$1241: Q49.3(D) R304.2
N$1242: IC38.2(VO) R277.2
N$1243: IC38.3(VI) Q47.2(C)
N$1244: IC42.5(CV)
N$1245: IC42.3(Q) IC43.4(A:A) IC43.12(B:A)
N$1246: D68.1(+) R308.1
N$1247: 11.10 D60.2(-) D61.2(-) JP25.1 TP125.TP(PP)
N$1248: JP25.2 R309.2 R310.2
N$1249: IC43.9(B:!Q) IC43.11(B:B) R313.2
N$1250: C59.1 IC43.14(B:T2) R311.1
N$1251: JP21.1 R312.2
N$1252: IC39.15(O2) R299.1
N$1253: 12.12 R313.1 TP138.TP(PP)
N$1254: D65.1(+) JP23.2
N$1255: IC45.1(A:OUT) R314.2
N$1256: C60.1 R314.1 R315.1
N$1257: IC45.5(B:+IN) Q51.3(D) R315.2 R316.2
N$1258: IC45.6(B:-IN) R317.1 R318.2
N$1259: D66.1(+) JP24.1
N$1260: JP22.3 R304.1
N$1261: IC40.13(D:OUT) JP22.1 Q49.1(G) R305.2
N$1262: R296.1 X13.21
N$1263: IC39.16(O1) Q50.3(D) R326.1
N$1264: D71.2(-) R329.1 R330.1
N$1265: 11.8 R326.2 TP123.TP(PP)
N$1266: Q50.2(S) R325.2
N$1267: D72.1(+) X13.1
N$1268: Q48.3(E) R323.1
N$1269: C57.2 D68.2(-) D73.C IC42.2(TR) IC42.6(THR) R306.1
N$1270: Q52.1(B) R327.1
N$1271: Q53.3(D) R327.2
N$1272: Q52.2(C) R278.2 SJMP5.2
N$1273: IC45.7(B:OUT) R296.2 R303.1 R316.1
N$1274: IC40.2(A:OUT) R290.1
N$1275: IC43.7(A:!Q) Q53.1(G)
N$1276: C61.2 IC43.2(A:T2) R328.1
V+: D71.1(+) Q44.3(E) Q47.3(E) Q52.3(E) SJMP5.1 X13.6 ; also sheet 2,3,4,5,6,9,10,11,12,13,14
VCC: 6V5.TP(PP) C53.1 IC40.3(P:V+) IC41.1(OUT) IC45.8(P:V+) R285.2 R288.2 R291.1 R317.2 ; also sheet 2,3,4,5,6,9,10,11,12,13,14
Unconnected: IC37.4(Q7) IC37.5(Q9) IC37.7(Q6) IC37.9(Q8) IC42.7(DIS) IC43.6(A:Q) IC43.10(B:Q) X13.20 X13.24

### Notes on the sheet
- Externe Beschaltung
- Variante "eine LED leuchtet"
- Variante "alle LEDs bis und
   mit Gang X leuchten"
- Anzeige:
- Klemmleisten
  Ausgang:
- Gang 1
- DauerPlus
  Konstant-Strom für LEDs
  Gang 1
  Gang 2
  Gang 3
  Gang 4
  Gang 5
  Neutrallampe
  Blinker rechts
  Blinker zusammen
  Blinker links
  Masse
- Gang 1
- Gang 2
- Gang 2
- Gang 3
- Gang 3
- Gang 1 | Gang 2 | Gang 3 | Gang 4 | Gang 5
- Gang 4
- Gang 4 | Klemmleisten Ausgang:
- Gang 5
- Gang 5
- Zündugsplus
  Choke
  Öldrucklampe
  Temperaturlampe
  Ladekontrolllampe
  Tankgeber (100hm)
  ABS-Lampe
  Lampentest
  Warnlampe
  Fernlichtlampe
  Geschwindigkeitssignal
  Menütaster
- Stromquelle für Gang
  LEDs. Für mehr als 12mA
  muss ein Widerstand "R_user"
  eingelötet werden. Für weniger
  muss der 1kOhm SMD Widerstand
  neben R_user entfernt werden
  I = 12V/1kOhm(default)+12V/R_user
  I= 12mA (default) + 12V/R_user
  Beispiel:
  R_user      Strom in LEDs
  1 kOhm     22-26mA
  ohne       11-13mA
- Externe Beschaltung
- an Zündungsplus anhängen
  (Neutral leuchtet wenn Gang 0
  eingelegt und Zündschlüssel steckt )
- Neutrallampe
  für eigene
  Ganganzeige
- DauerPlus Batterie 12V (rot weiss)
  Ganganzeige Signal C (gelb weiss)
  Ganganzeige Signal B (gelb schwarz)
  Ganganzeige Signal A (gelb dunkelblau)
  12V/350mA zum Starknopf (schwarz grün)
  Zündungsplus 12V (grün schwarz)
  Reservelampe (weiss)
  ABS Leuchte (blau)
  Ladekontrollleuchte (schaltet auf Masse) (violett schwarz)
  Temperaturleuchte (schaltet auf Masse) (braun schwarz)
  Öldruckleuchte (schaltet auf Masse) (braun grün)
  Chokelampe (schaltet auf Masse) (violett weiss)
- BL resistors
- 1k
- an Ausgang "Neutrallampe" anhängen
- Masse (braun)
  Lampentest (schaltet auf Masse)(weiss blau)
  Fernlichtlampe (12V) (weiss)
  Drehzahl Zündspule (schwarz blau)
  Blinker rechts (blau scharz)
  Masse (braun)
  Blinker links (blau rot)
  nicht angeschlossen
  Tachosiganl zum Blinrelais (balu grün)
  Tachogeber (gelb)
  Masse Tachobeger (braun)
  Tachobeleuchtung (12V Zündungsplus) (grau blau)
- RES | BAR
- 4.7V | rising edge trigger A
- non retriggerable
- ZündungsPlus
- current source 96mA
- 6V regulated for Opamps
- nicht bestückt
- retriggerable
- Standard panel Fiducial | panel Fiducial with solder mask around fiducial

## Sheet 8 of 14
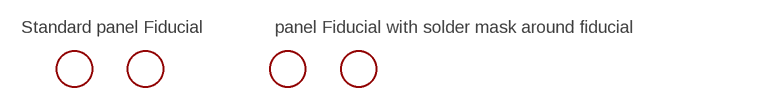
[diagram p13: schematic, sheet 8]

### Parts
FID1B1  FIDUCIALFIDUCIAL_1MM_WITH_SOLDERMASK  [FIDUCIAL_1MM_WITH_SOLDERMASK]
FID2B1  FIDUCIALFIDUCIAL_1MM_WITH_SOLDERMASK  [FIDUCIAL_1MM_WITH_SOLDERMASK]
FID23  FIDUCIAL  [FIDUCIAL_1MM]
FID24  FIDUCIAL  [FIDUCIAL_1MM]

### Notes on the sheet
- Standard panel Fiducial | panel Fiducial with solder mask around fiducial

## Sheet 9 of 14
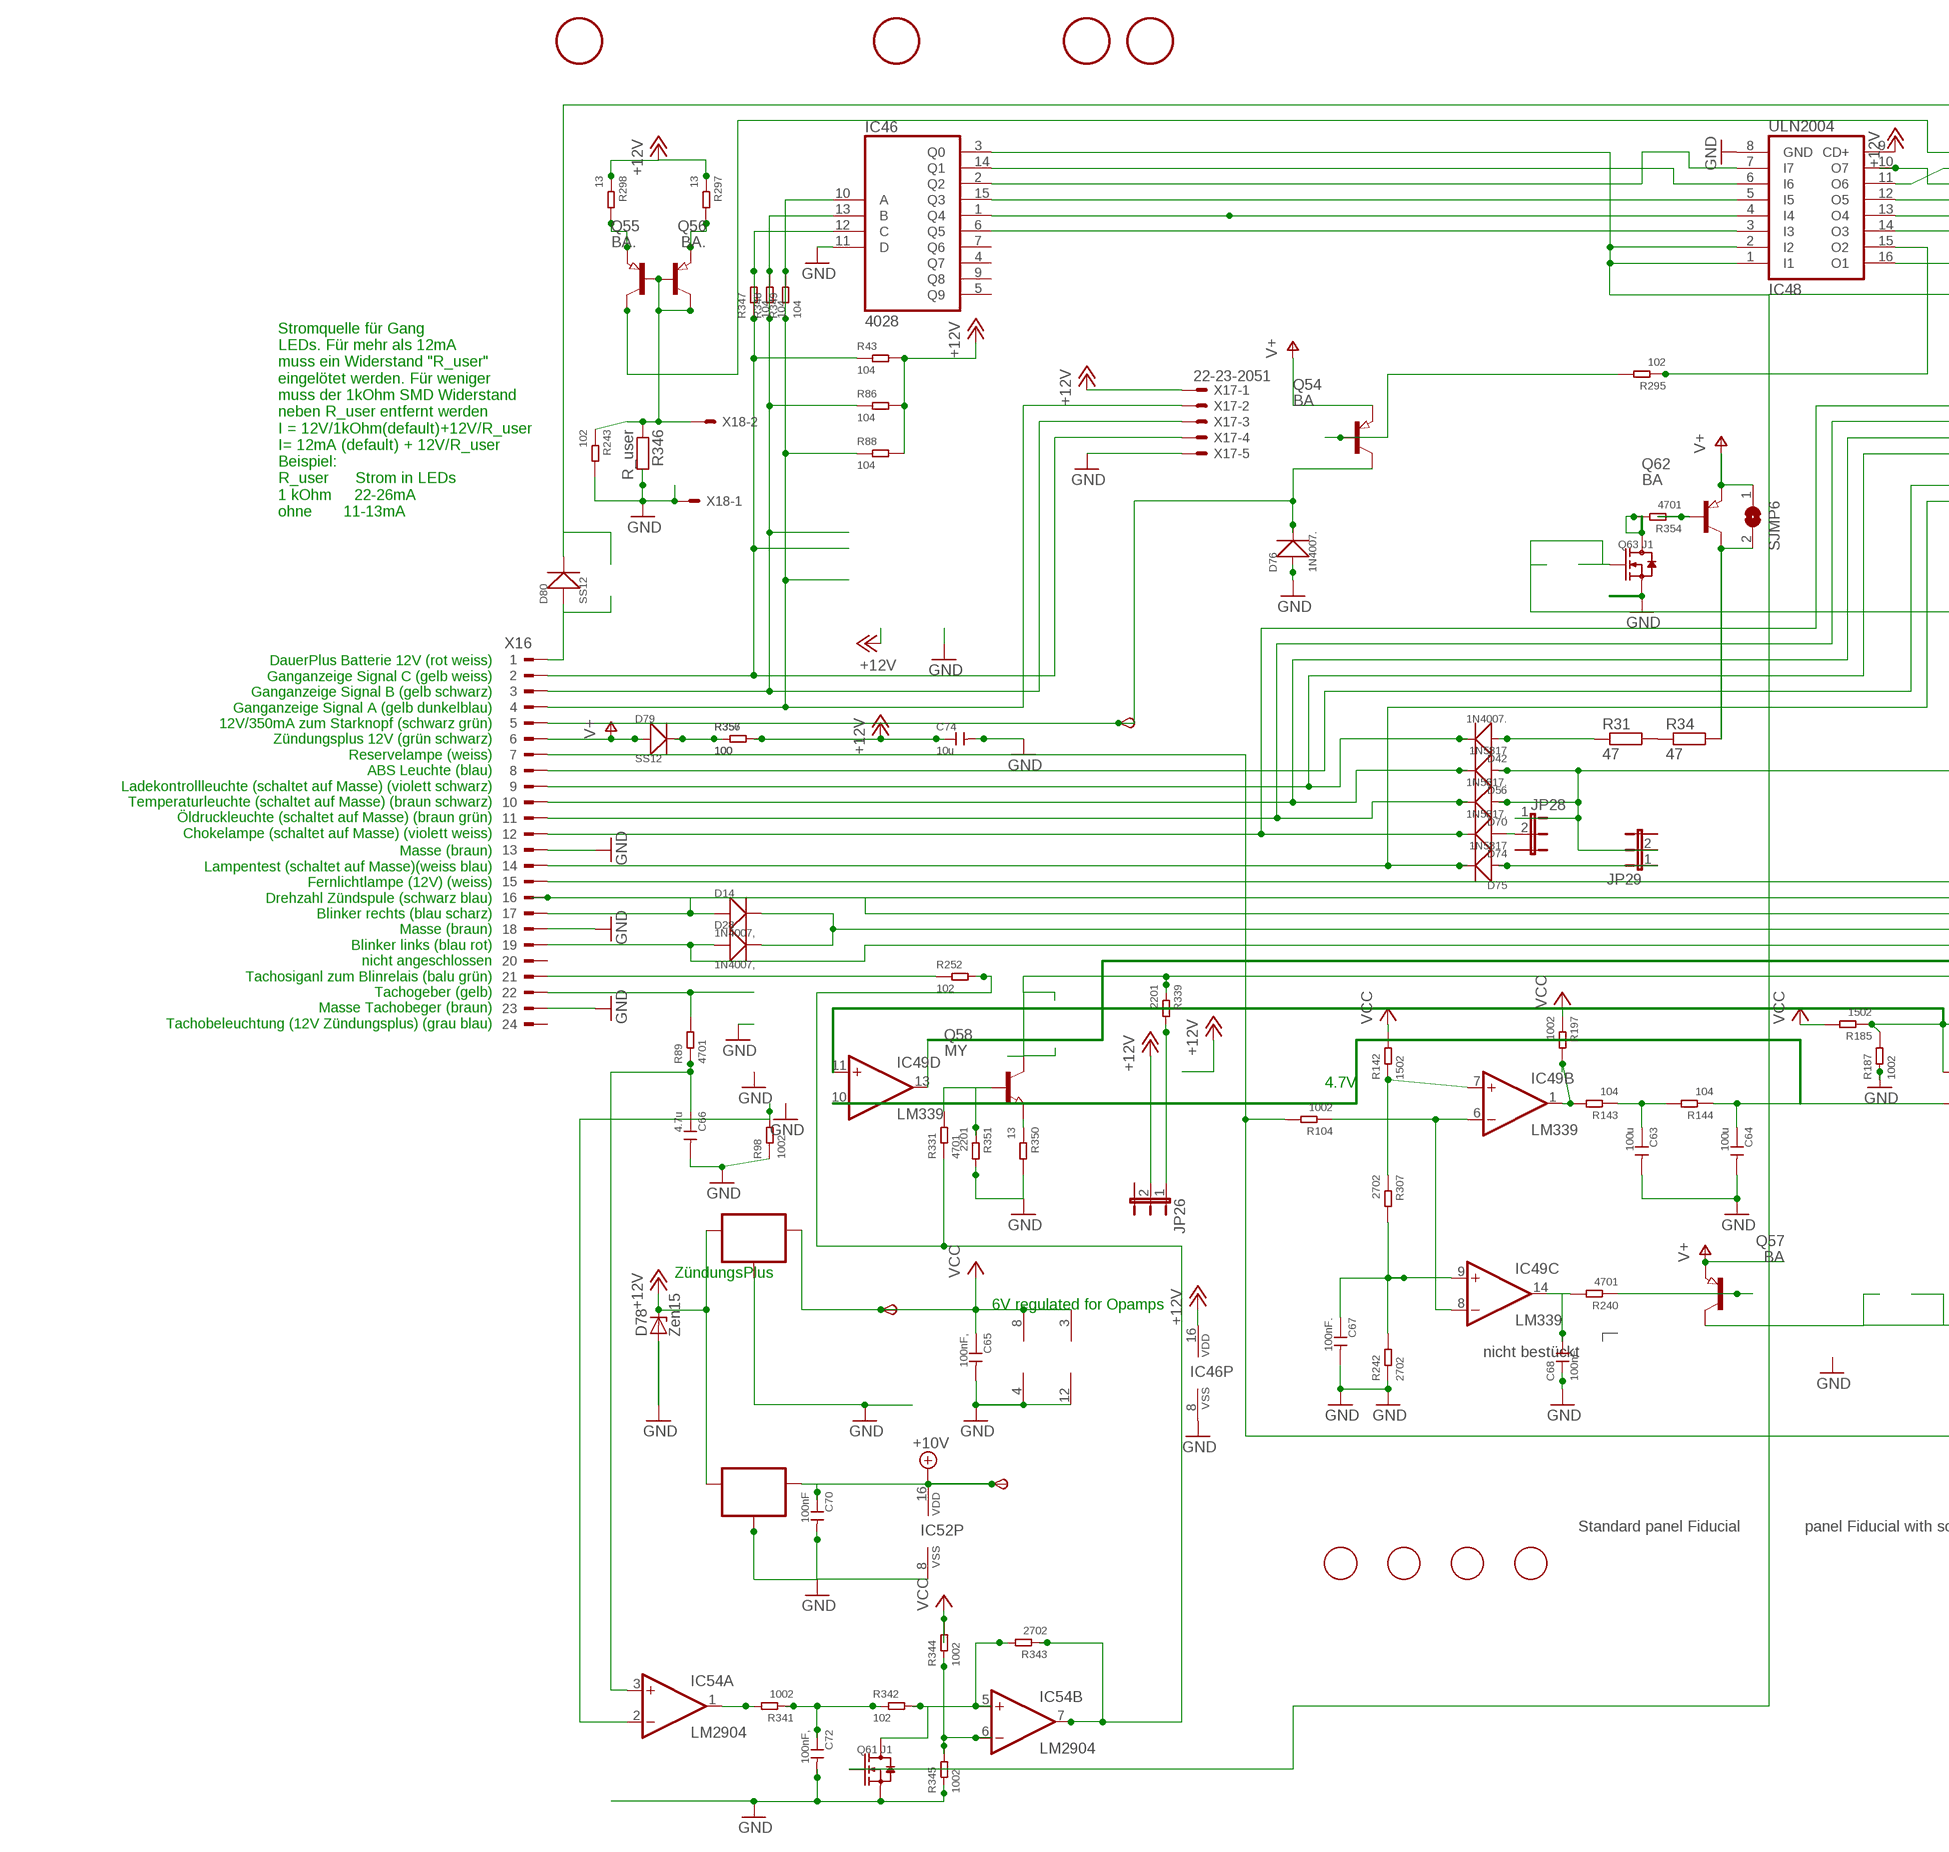
[diagram p14: schematic, sheet 9, part 1 of 2]
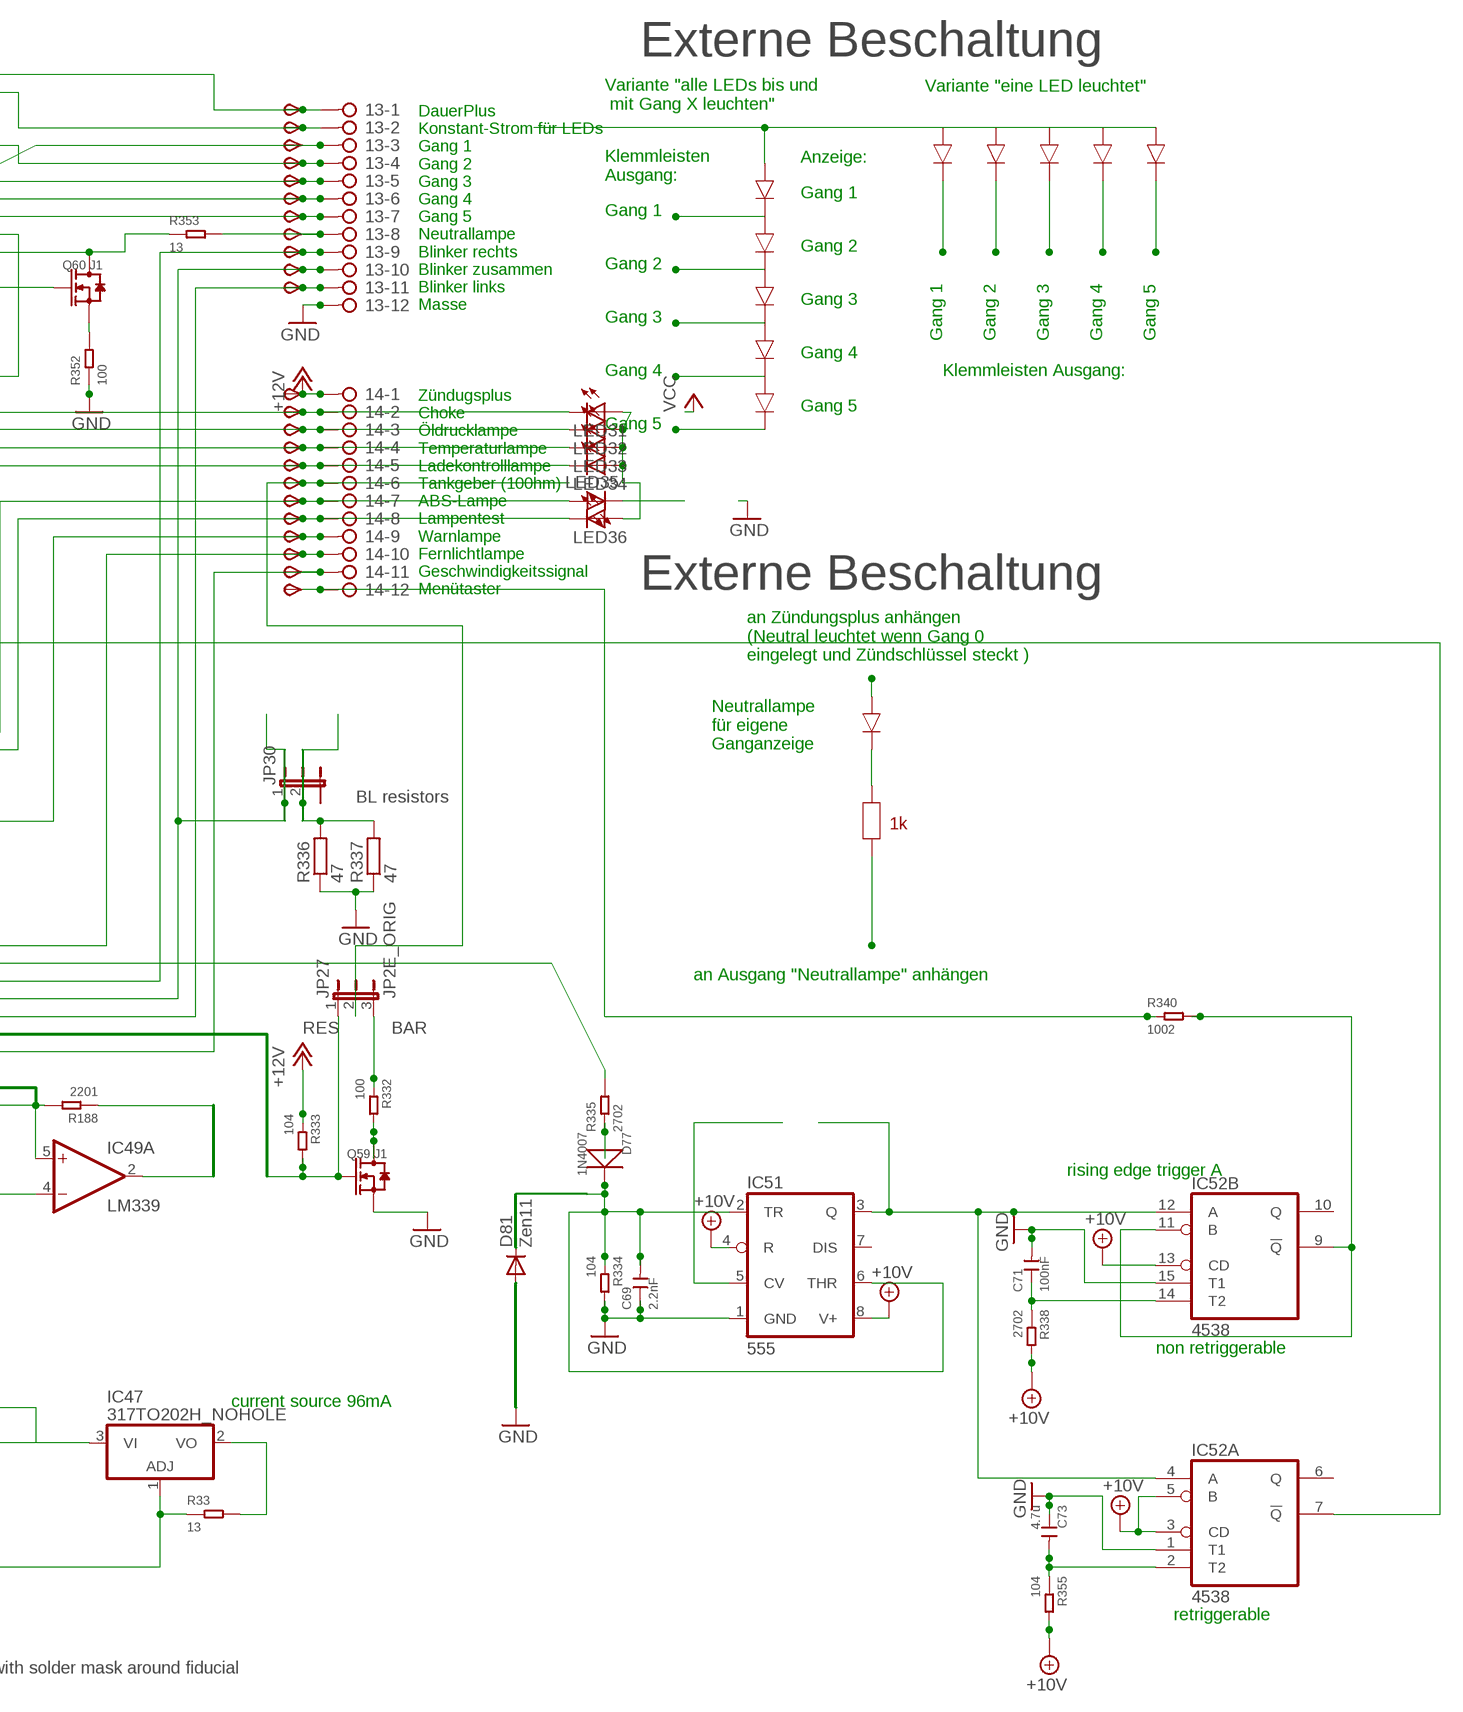
[diagram p15: schematic, sheet 9, part 2 of 2]

### Parts
6V6  TPSB2.0  [B2.0]
10V6  TPSB2.0  [B2.0]
13  2081-1132  [12-PIN]
14  2081-1132  [12-PIN]
C63  100u  CERAMIC-100UF-6.3V-20%-X5R(1206)  [C1206]
C64  100u  CERAMIC-100UF-6.3V-20%-X5R(1206)  [C1206]
C65  100nF,  CERAMIC-100NF-50V-10%-X7R(0805)  [C0805]
C66  4.7u  CERAMIC-4.7UF-25V-10%-X5R(0805)  [C0805]
C67  100nF.  CERAMIC-100NF-50V-10%-X7R(0805)  [C0805]
C68  100nF.  CERAMIC-100NF-50V-10%-X7R(0805)  [C0805]
C69  2.2nF  CERAMIC-100NF-50V-10%-X7R(0805)  [C0805]
C70  100nF  CERAMIC-100NF-50V-10%-X7R(0805)  [C0805]
C71  100nF  CERAMIC-100NF-50V-10%-X7R(0805)  [C0805]
C72  100nF,  CERAMIC-100NF-50V-10%-X7R(0805)  [C0805]
C73  4.7u  CERAMIC-4.7UF-25V-10%-X5R(0805)  [C0805]
C74  10u  CERAMIC-100UF-6.3V-20%-X5R(1206)  [C1206]
D14  1N4007,  DIODE-GEN-PURPOSE-1KV-1A(DO-214AC)  [DO-214AC]
D28  1N4007,  DIODE-GEN-PURPOSE-1KV-1A(DO-214AC)  [DO-214AC]
D42  1N4007.  DIODE-GEN-PURPOSE-1KV-1A(DO-214AC)  [DO-214AC]
D56  1N5817  DIODE-GEN-PURPOSE-1KV-1A(DO-214AC)DO-214AC/1206  [DO-214AC_SLIM]
D70  1N5817.  DIODE-GEN-PURPOSE-1KV-1A(DO-214AC)DO-214AC/1206  [DO-214AC_SLIM]
D74  1N5817.  DIODE-GEN-PURPOSE-1KV-1A(DO-214AC)DO-214AC/1206  [DO-214AC_SLIM]
D75  1N5817  DIODE-GEN-PURPOSE-1KV-1A(DO-214AC)DO-214AC/1206  [DO-214AC_SLIM]
D76  1N4007.  DIODE-GEN-PURPOSE-1KV-1A(DO-214AC)  [DO-214AC]
D77  1N4007  DIODE-GEN-PURPOSE-1KV-1A(DO-214AC)  [DO-214AC]
D78  Zen15  SM6T  [DO214AA]
D79  SS12  DIODE-GEN-PURPOSE-1KV-1A(DO-214AC)DO-214AC/1206  [DO-214AC_SLIM]
D80  SS12  DIODE-GEN-PURPOSE-1KV-1A(DO-214AC)DO-214AC/1206  [DO-214AC_SLIM]
D81  Zen11  CGRM4001-G  [SOD-123_MINI-SMA]
FID25  FIDUCIAL  [FIDUCIAL_1MM]
FID26  FIDUCIAL  [FIDUCIAL_1MM]
FID27  FIDUCIAL  [FIDUCIAL_1MM]
FID28  FIDUCIAL  [FIDUCIAL_1MM]
IC46  4028  4028D  [SO16]
IC47  317TO202H_NOHOLE  [TO220H_NOHOLE]
IC48  ULN2004  ULN2004AD  [SO16]
IC49  LM339  LM339D  [SO14]
IC50  78L06  78LXXSOT89_ROUND  [SOT89_ROUND]
IC51  555  NE555D  [SO08]
IC52  4538  4538D  [SO16]
IC53  78L10  78LXXSOT89_ROUND  [SOT89_ROUND]
IC54  LM2904  LM358D  [SO08]
JP26  JP2EJP2_SMALLPADS  [JP2_SMALLPADS]
JP27  JP2E_ORIG  [JP2_ORIG_SMALLPADS]
JP28  JP2EJP2_SMALLPADS  [JP2_SMALLPADS]
JP29  JP2EJP2_SMALLPADS  [JP2_SMALLPADS]
JP30  JP2EJP2_SMALLPADS  [JP2_SMALLPADS]
LED31  LEDLD260  [LD260]
LED32  LEDLD260  [LD260]
LED33  LEDLD260  [LD260]
LED34  LEDLD260  [LD260]
LED35  LEDLD260  [LD260]
LED36  LEDLD260  [LD260]
Q54  BA  PNP-TRANSISTOR_SOT89  [SOT89]
Q55  BA.  PNP-TRANSISTOR_SOT89  [SOT89]
Q56  BA.  PNP-TRANSISTOR_SOT89  [SOT89]
Q57  BA  PNP-TRANSISTOR_SOT89  [SOT89]
Q58  MY  NPN-TRANSISTOR_SOT89  [SOT89]
Q59  J1  SMD-MOSFET-N-CH-50V-200MA-BSS138W-7-F(SOT-23)  [SOT-23]
Q60  J1  SMD-MOSFET-N-CH-50V-200MA-BSS138W-7-F(SOT-23)  [SOT-23]
Q61  J1  SMD-MOSFET-N-CH-50V-200MA-BSS138W-7-F(SOT-23)  [SOT-23]
Q62  BA  PNP-TRANSISTOR_SOT89  [SOT89]
Q63  J1  SMD-MOSFET-N-CH-50V-200MA-BSS138W-7-F(SOT-23)  [SOT-23]
R31  47  R-EU_V235/17_1MM  [V235/17_1MM]
R33  13  SMD-RES-13R-5%-1/4W(1206)  [R1206]
R34  47  R-EU_V235/17_1MM  [V235/17_1MM]
R43  104  SMD-RES-10K-1%-1/8W(0805)  [R0805]
R86  104  SMD-RES-10K-1%-1/8W(0805)  [R0805]
R88  104  SMD-RES-10K-1%-1/8W(0805)  [R0805]
R89  4701  SMD-RES-4.7K-5%-1/8W(0805)  [R0805]
R98  1002  SMD-RES-10K-1%-1/8W(0805)  [R0805]
R104  1002  SMD-RES-10K-1%-1/8W(0805)  [R0805]
R142  1502  SMD-RES-10K-1%-1/8W(0805)  [R0805]
R143  104  SMD-RES-10K-1%-1/8W(0805)  [R0805]
R144  104  SMD-RES-10K-1%-1/8W(0805)  [R0805]
R185  1502  SMD-RES-10K-1%-1/8W(0805)  [R0805]
R187  1002  SMD-RES-10K-1%-1/8W(0805)  [R0805]
R188  2201  SMD-RES-2.2K-5%-1/8W(0805)  [R0805]
R197  1002  SMD-RES-10K-1%-1/8W(0805)  [R0805]
R240  4701  SMD-RES-4.7K-5%-1/8W(0805)  [R0805]
R242  2702  SMD-RES-4.7K-5%-1/8W(0805)  [R0805]
R243  102  SMD-RES-1K-5%-1/8W(0805)  [R0805]
R252  102  SMD-RES-220R-5%-1/8W(0805)  [R0805]
R295  102  SMD-RES-1K-5%-1/8W(0805)  [R0805]
R297  13  SMD-RES-13R-5%-1/4W(1206)  [R1206]
R298  13  SMD-RES-13R-5%-1/4W(1206)  [R1206]
R307  2702  SMD-RES-4.7K-5%-1/8W(0805)  [R0805]
R331  4701  SMD-RES-4.7K-5%-1/8W(0805)  [R0805]
R332  100  SMD-RES-2.2K-5%-1/8W(0805)  [R0805]
R333  104  SMD-RES-10K-1%-1/8W(0805)  [R0805]
R334  104  SMD-RES-10K-1%-1/8W(0805)  [R0805]
R335  2702  SMD-RES-10K-1%-1/8W(0805)  [R0805]
R336  47  R-EU_V235/17_1MM  [V235/17_1MM]
R337  47  R-EU_V235/17_1MM  [V235/17_1MM]
R338  2702  SMD-RES-4.7K-5%-1/8W(0805)  [R0805]
R339  2201  SMD-RES-2.2K-5%-1/8W(0805)  [R0805]
R340  1002  SMD-RES-4.7K-5%-1/8W(0805)  [R0805]
R341  1002  SMD-RES-10K-1%-1/8W(0805)  [R0805]
R342  102  SMD-RES-1K-5%-1/8W(0805)  [R0805]
R343  2702  SMD-RES-4.7K-5%-1/8W(0805)  [R0805]
R344  1002  SMD-RES-1K-5%-1/8W(0805)  [R0805]
R345  1002  SMD-RES-1K-5%-1/8W(0805)  [R0805]
R346  R_user  R-EU_R0805  [R0805]
R347  104  SMD-RES-10K-1%-1/8W(0805)  [R0805]
R348  104  SMD-RES-10K-1%-1/8W(0805)  [R0805]
R349  104  SMD-RES-10K-1%-1/8W(0805)  [R0805]
R350  13  SMD-RES-13R-5%-1/4W(1206)  [R1206]
R351  2201  SMD-RES-1K-5%-1/8W(0805)  [R0805]
R352  100  SMD-RES-220R-5%-1/8W(0805)  [R0805]
R353  13  SMD-RES-13R-5%-1/4W(1206)  [R1206]
R354  4701  SMD-RES-4.7K-5%-1/8W(0805)  [R0805]
R355  104  SMD-RES-4.7K-5%-1/8W(0805)  [R0805]
R356  100  SMD-RES-2.2K-5%-1/8W(0805)  [R0805]
R357  100  SMD-RES-2.2K-5%-1/8W(0805)  [R0805]
SJMP6  SJ  [SJ]
START6  TPSB2.0  [B2.0]
TP139  TPSB2.0  [B2.0]
TP140  TPSB2.0  [B2.0]
TP141  TPSB2.0  [B2.0]
TP142  TPSB2.0  [B2.0]
TP143  TPSB2.0  [B2.0]
TP144  TPSB2.0  [B2.0]
TP145  TPSB2.0  [B2.0]
TP146  TPSB2.0  [B2.0]
TP147  TPSB2.0  [B2.0]
TP148  TPSB2.0  [B2.0]
TP149  TPSB2.0  [B2.0]
TP150  TPSB2.0  [B2.0]
TP151  TPSB2.0  [B2.0]
TP152  TPSB2.0  [B2.0]
TP153  TPSB2.0  [B2.0]
TP154  TPSB2.0  [B2.0]
TP155  TPSB2.0  [B2.0]
TP156  TPSB2.0  [B2.0]
TP157  TPSB1,27  [B1,27]
TP158  TPSB2.0  [B2.0]
TP159  TPSB2.0  [B2.0]
TP160  TPSB2.0  [B2.0]
TP161  TPSB2.0  [B2.0]
U$25  STC  [STENCIL_HOLE]
U$30  STC  [STENCIL_HOLE]
U$33  STC  [STENCIL_HOLE]
U$34  STC  [STENCIL_HOLE]
X16  CON_BMWV2  [24-PIN_V2]
X17  22-23-2051  [22-23-2051]
X18  22-23-2021  [22-23-2021]

### Nets
+10V: 10V6.TP(PP) C70.1 IC51.4(R) IC51.8(V+) IC52.3(A:CD) IC52.5(A:B) IC52.13(B:CD) IC52.16(P:VDD) IC53.1(OUT) R338.2 R355.2 ; also sheet 2,3,4,5,6,7,10,11,12,13,14
+12V: 14.1 C74.1 D78.C IC46.16(VDD) IC48.9(CD+) IC50.3(IN) IC53.3(IN) JP26.2 R43.2 R86.2 R88.2 R297.1 R298.1 R333.1 R356.2 R357.2 TP160.TP(PP) X17.1 ; also sheet 2,3,4,5,6,7,10,11,12,13,14
+12V7: 14.11 Q58.2(C) R339.1 TP159.TP(PP)
GND: 13.12 C63.2 C64.2 C65.2 C66.2 C67.2 C68.1 C69.1 C70.2 C71.2 C72.2 C73.1 C74.2 D76.1(+) D78.A D81.A IC46.8(VSS) IC46.11(D) IC48.8(GND) IC49.12(P:GND) IC50.2(GND) IC50.2@1(GND) IC51.1(GND) IC52.1(A:T1) IC52.8(P:VSS) IC52.15(B:T1) IC53.2(GND) IC53.2@1(GND) IC54.4(P:V-) Q59.2(S) Q61.2(S) Q63.2(S) R98.1 R187.1 R242.1 R243.2 R334.2 R336.1 R337.1 R345.1 R346.2 R350.2 R351.2 R352.1 X16.13 X16.18 X16.23 X17.5 X18.1 ; also sheet 2,3,4,5,6,7,10,11,12,13,14
N$1400: R31.2 R34.1
N$1401: 14.9 D56.1(+) D70.1(+) JP28.1 JP29.2 TP157.TP(PP)
N$1402: IC46.10(A) R88.1 R349.1 R349.2 X16.4 X17.2
N$1403: IC46.13(B) R86.1 R348.1 R348.2 X16.3 X17.3
N$1404: D76.2(-) Q54.2(C) START6.TP(PP) X16.5
N$1405: IC46.12(C) R43.1 R347.1 R347.2 X16.2 X17.4
N$1406: 14.7 LED35.A TP155.TP(PP) X16.8
N$1407: 14.2 D74.2(-) LED31.K(C) TP150.TP(PP) X16.12
N$1408: 14.3 D70.2(-) LED32.K(C) TP151.TP(PP) X16.11
N$1409: 14.4 D56.2(-) LED33.K(C) TP152.TP(PP) X16.10
N$1410: 14.8 D75.2(-) LED36.K(C) TP156.TP(PP) X16.14
N$1411: 13.9 D14.1(+) TP147.TP(PP) X16.17
N$1412: 13.11 D28.1(+) TP149.TP(PP) X16.19
N$1413: R89.2 X16.22
N$1414: C66.1 IC54.3(A:+IN) R89.1
N$1415: IC49.1(B:OUT) R143.2 R197.2
N$1416: C63.1 R143.1 R144.2
N$1417: C64.1 IC49.4(A:-IN) IC49.10(D:-IN) R144.1
N$1418: IC49.5(A:+IN) IC49.11(D:+IN) R185.1 R187.2 R188.2
N$1419: C67.1 IC49.9(C:+IN) R242.2 R307.2
N$1420: C68.2 IC49.14(C:OUT) R240.2
N$1421: Q57.1(B) R240.1
N$1422: IC46.2(Q2) IC48.7(I7)
N$1423: 13.5 IC48.12(O5) TP143.TP(PP)
N$1424: IC46.1(Q4) IC48.4(I4)
N$1425: 14.10 TP158.TP(PP) X16.15
N$1426: 14.5 D42.2(-) LED34.K(C) TP153.TP(PP) X16.9
N$1427: D42.1(+) R31.1
N$1428: IC46.6(Q5) IC48.3(I3)
N$1429: 13.4 IC48.10(O7) TP142.TP(PP)
N$1430: IC47.1(ADJ) R33.1 R104.2 X16.7
N$1431: IC49.6(B:-IN) IC49.8(C:-IN) R104.1
N$1432: 13.2 Q56.2(C) TP140.TP(PP)
N$1433: 13.1 D80.2(-) TP139.TP(PP)
N$1447: R335.2 X16.16
N$1448: IC46.15(Q3) IC48.5(I5)
N$1449: 13.6 IC48.13(O4) TP144.TP(PP)
N$1450: 13.7 IC48.14(O3) TP145.TP(PP)
N$1451: 14.6 JP27.2 TP154.TP(PP)
N$1452: LED35.K(C)
N$1453: LED31.A LED32.A LED33.A LED34.A LED36.A
N$1454: Q54.1(B) R295.2
N$1455: IC46.3(Q0) IC48.1(I1) IC48.2(I2) Q60.1(G) Q61.1(G)
N$1456: IC46.14(Q1) IC48.6(I6)
N$1457: 13.3 IC48.11(O6) TP141.TP(PP)
N$1458: Q55.1(B) Q55.2(C) Q56.1(B) R243.1 R346.1 X18.2
N$1459: Q56.3(E) R298.2
N$1460: Q55.3(E) R297.2
N$1461: IC49.7(B:+IN) R142.1 R307.1
N$1462: IC54.2(A:-IN) R98.2
N$1463: Q58.1(B) R331.2 R351.1
N$1464: Q59.3(D) R332.2
N$1465: IC47.2(VO) R33.2
N$1466: IC47.3(VI) Q57.2(C)
N$1467: IC51.5(CV)
N$1468: IC51.3(Q) IC52.4(A:A) IC52.12(B:A)
N$1469: D77.1(+) R335.1
N$1470: 13.10 D14.2(-) D28.2(-) JP30.1 TP148.TP(PP)
N$1471: JP30.2 R336.2 R337.2
N$1472: IC52.9(B:!Q) IC52.11(B:B) R340.2
N$1473: C71.1 IC52.14(B:T2) R338.1
N$1474: JP26.1 R339.2
N$1475: IC48.15(O2) R295.1
N$1476: 14.12 R340.1 TP161.TP(PP)
N$1477: D74.1(+) JP28.2
N$1478: IC54.1(A:OUT) R341.2
N$1479: C72.1 R341.1 R342.1
N$1480: IC54.5(B:+IN) Q61.3(D) R342.2 R343.2
N$1481: IC54.6(B:-IN) R344.1 R345.2
N$1482: D75.1(+) JP29.1
N$1483: JP27.3 R332.1
N$1484: IC49.13(D:OUT) JP27.1 Q59.1(G) R333.2
N$1485: R252.1 X16.21
N$1486: IC48.16(O1) Q60.3(D) R353.1
N$1487: D79.2(-) R356.1 R357.1
N$1488: 13.8 R353.2 TP146.TP(PP)
N$1489: Q60.2(S) R352.2
N$1490: D80.1(+) X16.1
N$1491: Q58.3(E) R350.1
N$1492: C69.2 D77.2(-) D81.C IC51.2(TR) IC51.6(THR) R334.1
N$1493: Q62.1(B) R354.1
N$1494: Q63.3(D) R354.2
N$1495: Q62.2(C) R34.2 SJMP6.2
N$1496: IC54.7(B:OUT) R252.2 R331.1 R343.1
N$1497: IC49.2(A:OUT) R188.1
N$1498: IC52.7(A:!Q) Q63.1(G)
N$1499: C73.2 IC52.2(A:T2) R355.1
V+: D79.1(+) Q54.3(E) Q57.3(E) Q62.3(E) SJMP6.1 X16.6 ; also sheet 2,3,4,5,6,7,10,11,12,13,14
VCC: 6V6.TP(PP) C65.1 IC49.3(P:V+) IC50.1(OUT) IC54.8(P:V+) R142.2 R185.2 R197.1 R344.2 ; also sheet 2,3,4,5,6,7,10,11,12,13,14
Unconnected: IC46.4(Q7) IC46.5(Q9) IC46.7(Q6) IC46.9(Q8) IC51.7(DIS) IC52.6(A:Q) IC52.10(B:Q) X16.20 X16.24

### Notes on the sheet
- Externe Beschaltung
- Variante "eine LED leuchtet"
- Variante "alle LEDs bis und
   mit Gang X leuchten"
- Anzeige:
- Klemmleisten
  Ausgang:
- Gang 1
- DauerPlus
  Konstant-Strom für LEDs
  Gang 1
  Gang 2
  Gang 3
  Gang 4
  Gang 5
  Neutrallampe
  Blinker rechts
  Blinker zusammen
  Blinker links
  Masse
- Gang 1
- Gang 2
- Gang 2
- Gang 3
- Gang 3
- Gang 1 | Gang 2 | Gang 3 | Gang 4 | Gang 5
- Gang 4
- Gang 4 | Klemmleisten Ausgang:
- Gang 5
- Gang 5
- Zündugsplus
  Choke
  Öldrucklampe
  Temperaturlampe
  Ladekontrolllampe
  Tankgeber (100hm)
  ABS-Lampe
  Lampentest
  Warnlampe
  Fernlichtlampe
  Geschwindigkeitssignal
  Menütaster
- Stromquelle für Gang
  LEDs. Für mehr als 12mA
  muss ein Widerstand "R_user"
  eingelötet werden. Für weniger
  muss der 1kOhm SMD Widerstand
  neben R_user entfernt werden
  I = 12V/1kOhm(default)+12V/R_user
  I= 12mA (default) + 12V/R_user
  Beispiel:
  R_user      Strom in LEDs
  1 kOhm     22-26mA
  ohne       11-13mA
- Externe Beschaltung
- an Zündungsplus anhängen
  (Neutral leuchtet wenn Gang 0
  eingelegt und Zündschlüssel steckt )
- Neutrallampe
  für eigene
  Ganganzeige
- DauerPlus Batterie 12V (rot weiss)
  Ganganzeige Signal C (gelb weiss)
  Ganganzeige Signal B (gelb schwarz)
  Ganganzeige Signal A (gelb dunkelblau)
  12V/350mA zum Starknopf (schwarz grün)
  Zündungsplus 12V (grün schwarz)
  Reservelampe (weiss)
  ABS Leuchte (blau)
  Ladekontrollleuchte (schaltet auf Masse) (violett schwarz)
  Temperaturleuchte (schaltet auf Masse) (braun schwarz)
  Öldruckleuchte (schaltet auf Masse) (braun grün)
  Chokelampe (schaltet auf Masse) (violett weiss)
- BL resistors
- 1k
- an Ausgang "Neutrallampe" anhängen
- Masse (braun)
  Lampentest (schaltet auf Masse)(weiss blau)
  Fernlichtlampe (12V) (weiss)
  Drehzahl Zündspule (schwarz blau)
  Blinker rechts (blau scharz)
  Masse (braun)
  Blinker links (blau rot)
  nicht angeschlossen
  Tachosiganl zum Blinrelais (balu grün)
  Tachogeber (gelb)
  Masse Tachobeger (braun)
  Tachobeleuchtung (12V Zündungsplus) (grau blau)
- RES | BAR
- 4.7V | rising edge trigger A
- non retriggerable
- ZündungsPlus
- current source 96mA
- 6V regulated for Opamps
- nicht bestückt
- retriggerable
- Standard panel Fiducial | panel Fiducial with solder mask around fiducial